# Altium project HV-60D.PrjPcb (part 1 of 2)
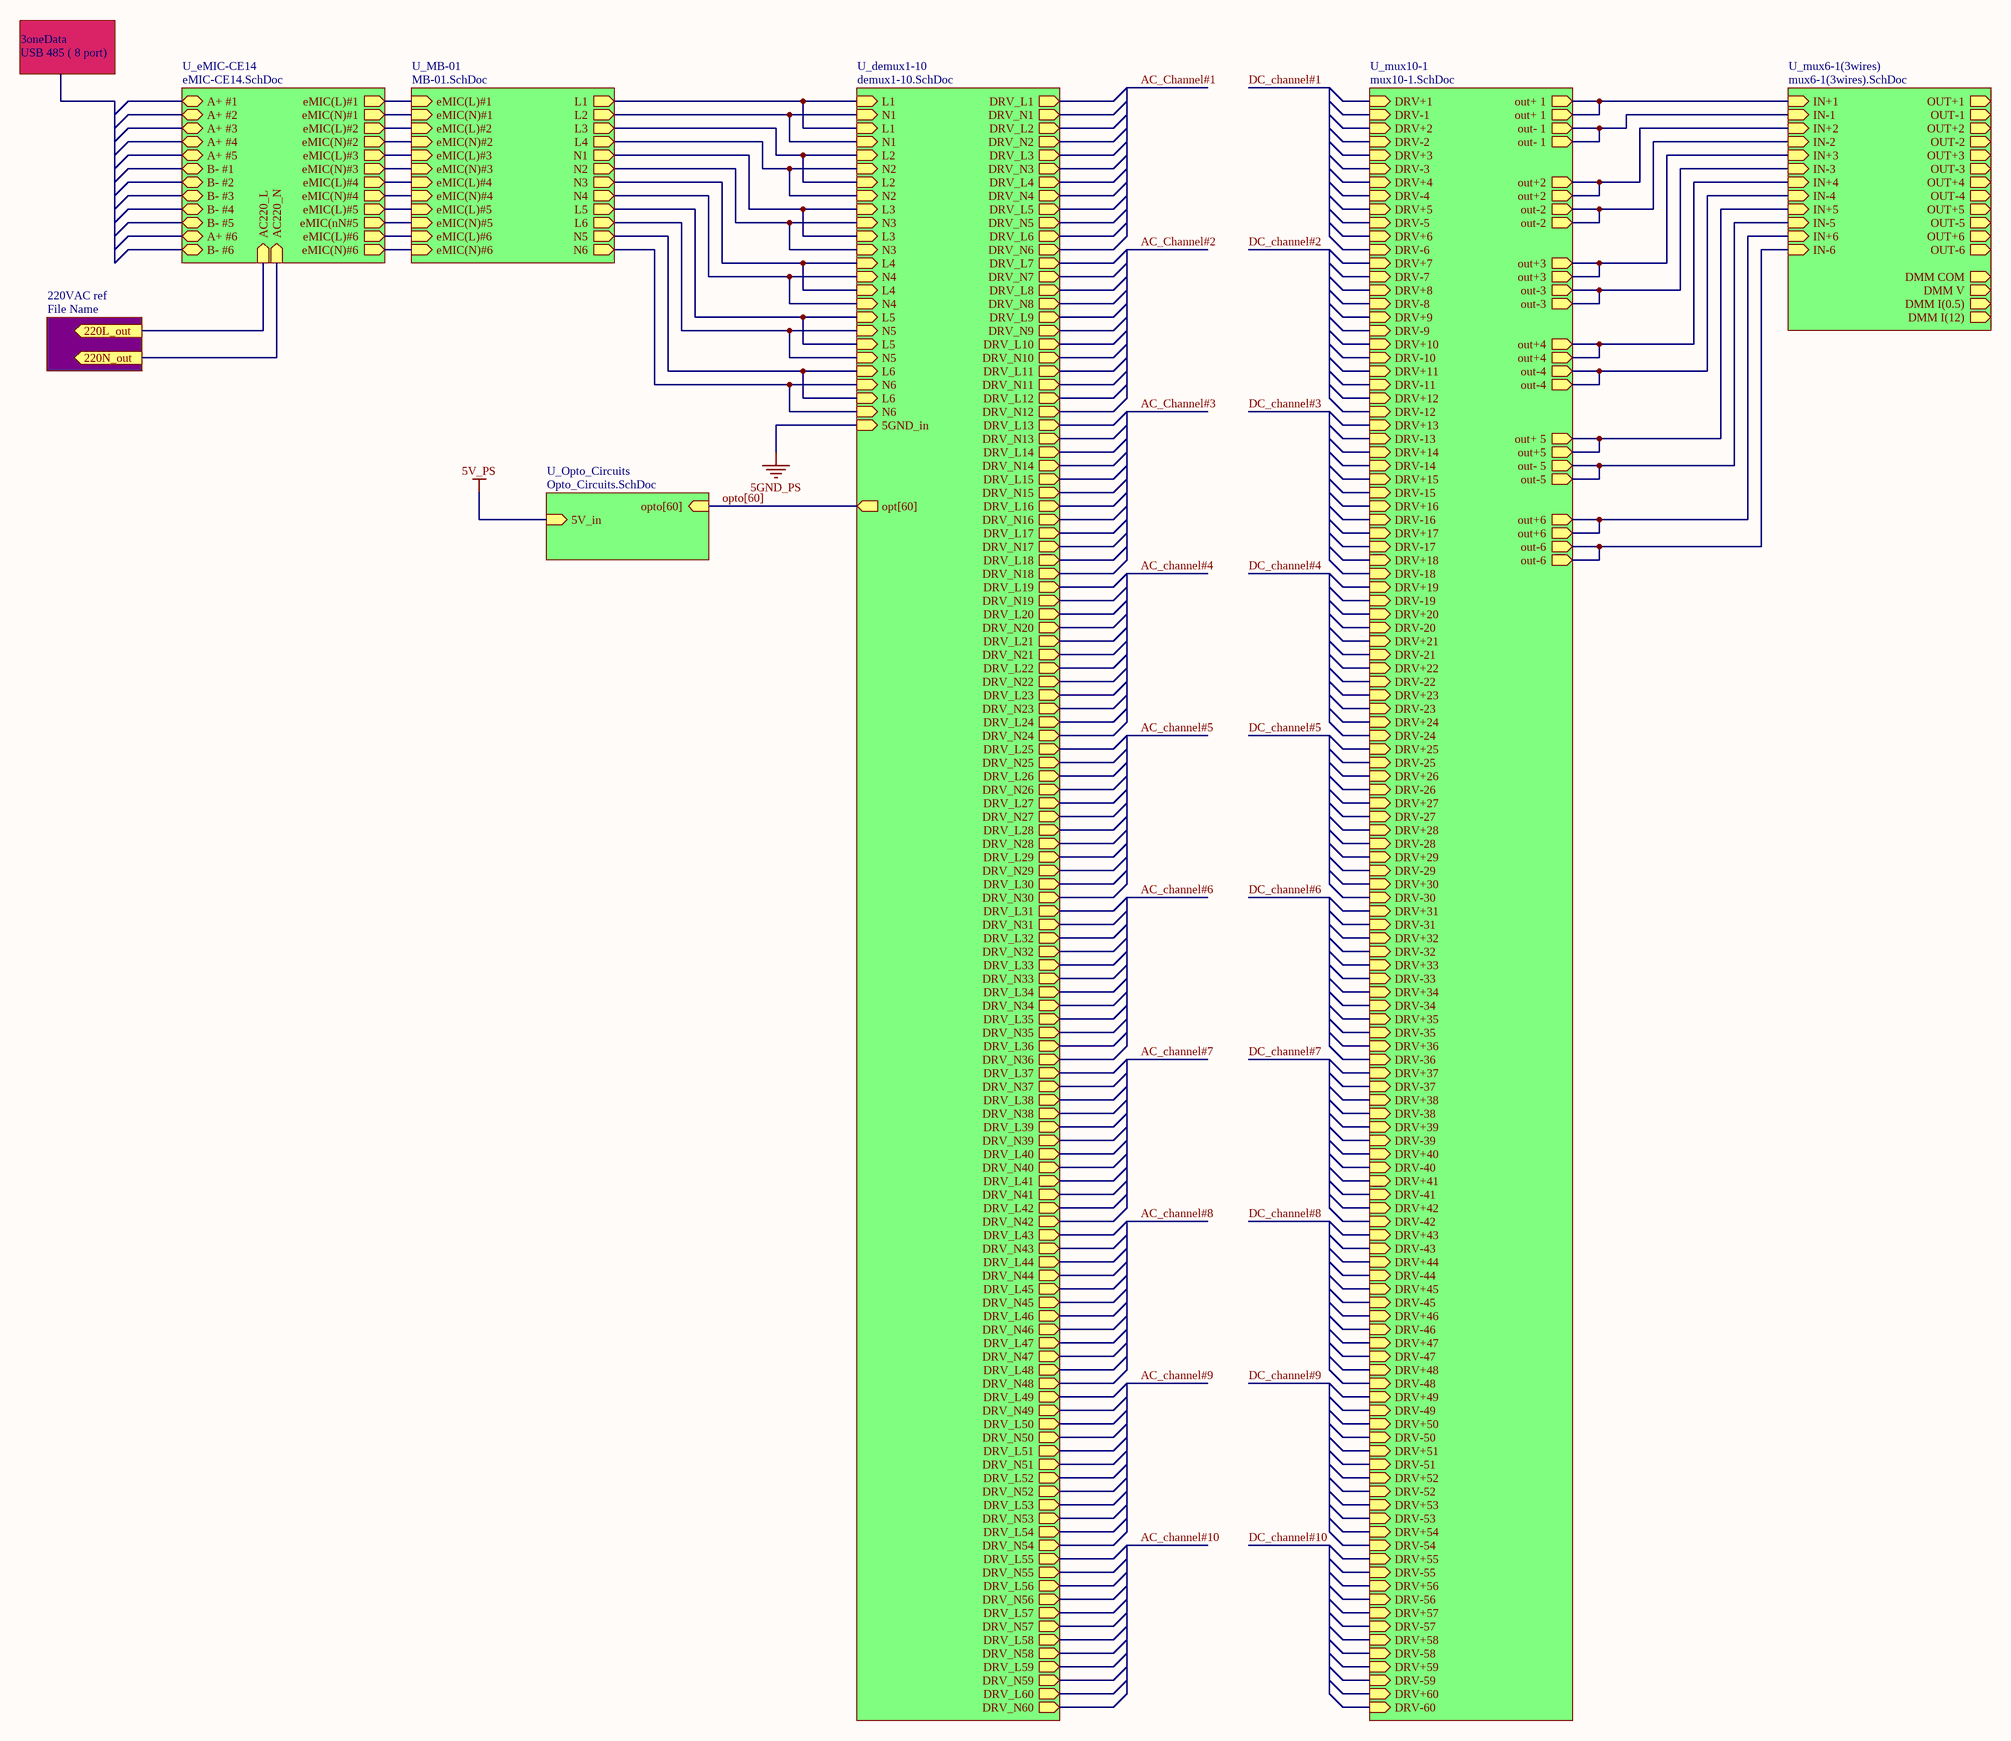
[diagram p0: HV60D_Top.SchDoc]
8 sheets, 92 parts. Net scope: hierarchical (ports join the sheet entries above them; power ports are global).
Sheets:
  HV60D_Top.SchDoc
    U_Opto_Circuits = Opto_Circuits.SchDoc
    U_demux1-10 = demux1-10.SchDoc
    U_MB-01 = MB-01.SchDoc
    U_eMIC-CE14 = eMIC-CE14.SchDoc
    U_mux10-1 = mux10-1.SchDoc
    U_mux6-1(3wires) = mux6-1(3wires).SchDoc
  mux6-1(3wires)_sche.SchDoc

## Sheet HV60D_Top.SchDoc
size A1

### Sub-sheets
220VAC ref = File Name (file not in this document): no entries
U_demux1-10 = demux1-10.SchDoc: L1 (in), N1 (in), L1 (in), N1 (in), DRV_L1 (out), DRV_L7 (out), L5 (in), N5 (in), L2 (in), N2 (in), L2 (in), N2 (in), L5 (in), N5 (in), L3 (in), N3 (in), L3 (in), N3 (in), L6 (in), N6 (in), L4 (in), N4 (in), L4 (in), N4 (in), L6 (in), N6 (in), DRV_L2 (out), DRV_L3 (out), DRV_L4 (out), DRV_L49 (out), DRV_L51 (out), DRV_L8 (out), DRV_L9 (out), DRV_L10 (out), DRV_L55 (out), DRV_L13 (out), DRV_L14 (out), DRV_L15 (out), DRV_L16 (out), DRV_L5 (out), DRV_L6 (out), DRV_L19 (out), DRV_L20 (out), DRV_L21 (out), DRV_L22 (out), DRV_L11 (out), DRV_L12 (out), DRV_L25 (out), DRV_L26 (out), DRV_L27 (out), DRV_L28 (out), DRV_L17 (out), DRV_L18 (out), DRV_L31 (out), DRV_L32 (out), DRV_L33 (out), DRV_L34 (out), DRV_L23 (out), DRV_L24 (out), DRV_L37 (out), DRV_L38 (out), DRV_L39 (out), DRV_L40 (out), DRV_L29 (out), DRV_L30 (out), DRV_L43 (out), DRV_L44 (out), DRV_L45 (out), DRV_L46 (out), DRV_L50 (out), DRV_L52 (out), DRV_L58 (out), DRV_L56 (out), DRV_L57 (out), DRV_L35 (out), DRV_L41 (out), DRV_L47 (out), DRV_L53 (out), DRV_L59 (out), DRV_L36 (out), DRV_L42 (out), DRV_L48 (out), DRV_L54 (out), DRV_L60 (out), DRV_N1 (out), DRV_N2 (out), DRV_N3 (out), DRV_N4 (out), DRV_N5 (out), DRV_N6 (out), DRV_N7 (out), DRV_N8 (out), DRV_N9 (out), DRV_N10 (out), DRV_N11 (out), DRV_N12 (out), DRV_N13 (out), DRV_N14 (out), DRV_N15 (out), DRV_N16 (out), DRV_N17 (out), DRV_N18 (out), DRV_N19 (out), DRV_N20 (out), DRV_N21 (out), DRV_N22 (out), DRV_N23 (out), DRV_N24 (out), DRV_N25 (out), DRV_N26 (out), DRV_N27 (out), DRV_N28 (out), DRV_N29 (out), DRV_N30 (out), DRV_N31 (out), DRV_N32 (out), DRV_N33 (out), DRV_N34 (out), DRV_N35 (out), DRV_N36 (out), DRV_N37 (out), DRV_N38 (out), DRV_N39 (out), DRV_N40 (out), DRV_N41 (out), DRV_N42 (out), DRV_N43 (out), DRV_N44 (out), DRV_N45 (out), DRV_N46 (out), DRV_N47 (out), DRV_N48 (out), DRV_N49 (out), DRV_N50 (out), DRV_N51 (out), DRV_N52 (out), DRV_N53 (out), DRV_N54 (out), DRV_N55 (out), DRV_N56 (out), DRV_N57 (out), DRV_N58 (out), DRV_N59 (out), DRV_N60 (out), opt[60] (out), 5GND_in (in)
U_eMIC-CE14 = eMIC-CE14.SchDoc: A+ #1 (bidir), A+ #2 (bidir), A+ #3 (bidir), A+ #4 (bidir), A+ #5 (bidir), B- #1 (bidir), B- #2 (bidir), B- #3 (bidir), B- #4 (bidir), B- #5 (bidir), A+ #6 (bidir), B- #6 (bidir), AC220_L (in), AC220_N (in), eMIC(L)#1 (out), eMIC(N)#1 (out), eMIC(L)#2 (out), eMIC(L)#3 (out), eMIC(L)#4 (out), eMIC(L)#5 (out), eMIC(L)#6 (out), eMIC(N)#2 (out), eMIC(N)#3 (out), eMIC(N)#4 (out), eMIC(nN#5 (out), eMIC(N)#6 (out)
U_MB-01 = MB-01.SchDoc: eMIC(L)#1 (in), eMIC(L)#2 (in), eMIC(L)#3 (in), eMIC(L)#4 (in), eMIC(N)#1 (in), eMIC(N)#2 (in), eMIC(N)#3 (in), eMIC(N)#4 (in), L1 (out), L2 (out), L3 (out), L4 (out), N1 (out), N2 (out), N3 (out), N4 (out), eMIC(L)#5 (in), eMIC(L)#6 (in), eMIC(N)#5 (in), eMIC(N)#6 (in), L5 (out), L6 (out), N5 (out), N6 (out)
U_mux6-1(3wires) = mux6-1(3wires).SchDoc: IN+1 (in), IN+2 (in), IN+3 (in), IN+4 (in), IN+5 (in), IN+6 (in), IN-1 (in), IN-2 (in), IN-3 (in), IN-4 (in), IN-5 (in), IN-6 (in), OUT+1 (out), OUT+2 (out), OUT+3 (out), OUT+4 (out), OUT+5 (out), OUT+6 (out), OUT-6 (out), OUT-5 (out), OUT-4 (out), OUT-3 (out), OUT-2 (out), OUT-1 (out), DMM COM (out), DMM V (out), DMM I(0.5) (out), DMM I(12) (out)
U_mux10-1 = mux10-1.SchDoc: out+ 1 (out), out- 1 (out), out+ 1 (out), out- 1 (out), out+ 5 (out), out- 5 (out), DRV+1 (in), DRV+7 (in), DRV+13 (in), DRV+19 (in), DRV+25 (in), DRV+31 (in), DRV+37 (in), DRV+43 (in), DRV-1 (in), DRV-7 (in), DRV-13 (in), DRV-19 (in), DRV-25 (in), DRV-31 (in), DRV-37 (in), DRV-43 (in), DRV+49 (in), DRV+55 (in), DRV+5 (in), DRV+11 (in), DRV+17 (in), DRV+23 (in), DRV+29 (in), DRV-49 (in), DRV-55 (in), DRV-5 (in), DRV-11 (in), DRV-17 (in), DRV-23 (in), DRV-29 (in), out+2 (out), out-2 (out), out+2 (out), out-2 (out), out+5 (out), out-5 (out), DRV+2 (in), DRV+8 (in), DRV+14 (in), DRV+20 (in), DRV+26 (in), DRV+32 (in), DRV+38 (in), DRV+44 (in), DRV-2 (in), DRV-8 (in), DRV-14 (in), DRV-20 (in), DRV-26 (in), DRV-32 (in), DRV-38 (in), DRV-44 (in), DRV+50 (in), DRV+56 (in), DRV+35 (in), DRV+41 (in), DRV+47 (in), DRV+53 (in), DRV+59 (in), DRV-50 (in), DRV-56 (in), DRV-35 (in), DRV-41 (in), DRV-47 (in), DRV-53 (in), DRV-59 (in), out+3 (out), out-3 (out), out+3 (out), out-3 (out), out+6 (out), out-6 (out), DRV+3 (in), DRV+9 (in), DRV+15 (in), DRV+21 (in), DRV+27 (in), DRV+33 (in), DRV+39 (in), DRV+45 (in), DRV-3 (in), DRV-9 (in), DRV-15 (in), DRV-21 (in), DRV-27 (in), DRV-33 (in), DRV-39 (in), DRV-45 (in), DRV+51 (in), DRV+57 (in), DRV+6 (in), DRV+12 (in), DRV+18 (in), DRV+24 (in), DRV+30 (in), DRV-51 (in), DRV-57 (in), DRV-6 (in), DRV-12 (in), DRV-18 (in), DRV-24 (in), DRV-30 (in), out+4 (out), out-4 (out), out+4 (out), out-4 (out), out+6 (out), out-6 (out), DRV+4 (in), DRV+10 (in), DRV+16 (in), DRV+22 (in), DRV+28 (in), DRV+34 (in), DRV+40 (in), DRV+46 (in), DRV-4 (in), DRV-10 (in), DRV-16 (in), DRV-22 (in), DRV-28 (in), DRV-34 (in), DRV-40 (in), DRV-46 (in), DRV+52 (in), DRV+58 (in), DRV+36 (in), DRV+42 (in), DRV+48 (in), DRV+54 (in), DRV+60 (in), DRV-52 (in), DRV-58 (in), DRV-36 (in), DRV-42 (in), DRV-48 (in), DRV-54 (in), DRV-60 (in)
U_Opto_Circuits = Opto_Circuits.SchDoc: opto[60] (in), 5V_in (in)
USB 485 ( 8 port) = 3oneData (file not in this document): no entries

### Ports
220L_out (out), 220N_out (out)

### Nets
COM_B_1: sheet U_demux1-10/L1, sheet U_demux1-10/L1, sheet U_demux1-10/L2, sheet U_demux1-10/L2, sheet U_demux1-10/L3, sheet U_demux1-10/L3, sheet U_demux1-10/L4, sheet U_demux1-10/L4, sheet U_MB-01/L1, sheet U_MB-01/L3, sheet U_MB-01/N1, sheet U_MB-01/N3
COM_B_1: sheet U_demux1-10/DRV_L1, sheet U_demux1-10/DRV_L2, sheet U_demux1-10/DRV_L3, sheet U_demux1-10/DRV_L4  [a separate net that carries the same name]
COM_B_1: sheet U_mux10-1/out+ 1, sheet U_mux10-1/out+ 1, sheet U_mux10-1/out+2, sheet U_mux10-1/out+2, sheet U_mux10-1/out+3, sheet U_mux10-1/out+3, sheet U_mux10-1/out+4, sheet U_mux10-1/out+4, sheet U_mux6-1(3wires)/IN+1, sheet U_mux6-1(3wires)/IN+2, sheet U_mux6-1(3wires)/IN+3, sheet U_mux6-1(3wires)/IN+4  [a separate net that carries the same name]
COM_B_2: sheet U_demux1-10/DRV_L7, sheet U_demux1-10/DRV_L8, sheet U_demux1-10/DRV_L9, sheet U_demux1-10/DRV_L10
COM_B_3: sheet U_demux1-10/N1, sheet U_demux1-10/N1, sheet U_demux1-10/N2, sheet U_demux1-10/N2, sheet U_demux1-10/N3, sheet U_demux1-10/N3, sheet U_demux1-10/N4, sheet U_demux1-10/N4, sheet U_MB-01/L2, sheet U_MB-01/L4, sheet U_MB-01/N2, sheet U_MB-01/N4
COM_B_3: sheet U_demux1-10/DRV_L13, sheet U_demux1-10/DRV_L14, sheet U_demux1-10/DRV_L15, sheet U_demux1-10/DRV_L16  [a separate net that carries the same name]
COM_B_4: sheet U_demux1-10/DRV_L19, sheet U_demux1-10/DRV_L20, sheet U_demux1-10/DRV_L21, sheet U_demux1-10/DRV_L22
COM_B_5: sheet U_demux1-10/DRV_L25, sheet U_demux1-10/DRV_L26, sheet U_demux1-10/DRV_L27, sheet U_demux1-10/DRV_L28
COM_B_6: sheet U_demux1-10/DRV_L31, sheet U_demux1-10/DRV_L32, sheet U_demux1-10/DRV_L33, sheet U_demux1-10/DRV_L34
COM_B_7: sheet U_demux1-10/DRV_L37, sheet U_demux1-10/DRV_L38, sheet U_demux1-10/DRV_L39, sheet U_demux1-10/DRV_L40
COM_B_8: sheet U_demux1-10/DRV_L43, sheet U_demux1-10/DRV_L44, sheet U_demux1-10/DRV_L45, sheet U_demux1-10/DRV_L46
COM_B_9: sheet U_demux1-10/DRV_L49, sheet U_demux1-10/DRV_L52
COM_B_10: sheet U_demux1-10/L5, sheet U_demux1-10/L5, sheet U_demux1-10/L6, sheet U_demux1-10/L6, sheet U_MB-01/L5, sheet U_MB-01/N5
COM_B_10: sheet U_demux1-10/DRV_L55, sheet U_demux1-10/DRV_L58, sheet U_demux1-10/DRV_L56, sheet U_demux1-10/DRV_L57  [a separate net that carries the same name]
COM_B_11: sheet U_demux1-10/N5, sheet U_demux1-10/N5, sheet U_demux1-10/N6, sheet U_demux1-10/N6, sheet U_MB-01/L6, sheet U_MB-01/N6
COM_B_11: sheet U_demux1-10/DRV_L5, sheet U_demux1-10/DRV_L6, sheet U_demux1-10/DRV_L35, sheet U_demux1-10/DRV_L36  [a separate net that carries the same name]
COM_B_11: sheet U_mux10-1/out+ 5, sheet U_mux10-1/out+5, sheet U_mux10-1/out+6, sheet U_mux10-1/out+6, sheet U_mux6-1(3wires)/IN+5, sheet U_mux6-1(3wires)/IN+6  [a separate net that carries the same name]
COM_B_12: sheet U_demux1-10/DRV_L11, sheet U_demux1-10/DRV_L12, sheet U_demux1-10/DRV_L41, sheet U_demux1-10/DRV_L42
COM_B_13: sheet U_demux1-10/DRV_L17, sheet U_demux1-10/DRV_L18, sheet U_demux1-10/DRV_L47, sheet U_demux1-10/DRV_L48
COM_B_14: sheet U_demux1-10/DRV_L23, sheet U_demux1-10/DRV_L24, sheet U_demux1-10/DRV_L53, sheet U_demux1-10/DRV_L54
COM_B_15: sheet U_demux1-10/DRV_L29, sheet U_demux1-10/DRV_L30, sheet U_demux1-10/DRV_L59, sheet U_demux1-10/DRV_L60
COM_C_1: sheet U_demux1-10/DRV_N1, sheet U_demux1-10/DRV_N2, sheet U_demux1-10/DRV_N3, sheet U_demux1-10/DRV_N4
COM_C_1: sheet U_mux10-1/out- 1, sheet U_mux10-1/out- 1, sheet U_mux10-1/out-2, sheet U_mux10-1/out-2, sheet U_mux10-1/out-3, sheet U_mux10-1/out-3, sheet U_mux10-1/out-4, sheet U_mux10-1/out-4, sheet U_mux6-1(3wires)/IN-1, sheet U_mux6-1(3wires)/IN-2, sheet U_mux6-1(3wires)/IN-3, sheet U_mux6-1(3wires)/IN-4  [a separate net that carries the same name]
COM_C_2: sheet U_demux1-10/DRV_N7, sheet U_demux1-10/DRV_N8, sheet U_demux1-10/DRV_N9, sheet U_demux1-10/DRV_N10
COM_C_3: sheet U_demux1-10/DRV_N13, sheet U_demux1-10/DRV_N14, sheet U_demux1-10/DRV_N15, sheet U_demux1-10/DRV_N16
COM_C_4: sheet U_demux1-10/DRV_N19, sheet U_demux1-10/DRV_N20, sheet U_demux1-10/DRV_N21, sheet U_demux1-10/DRV_N22
COM_C_5: sheet U_demux1-10/DRV_N25, sheet U_demux1-10/DRV_N26, sheet U_demux1-10/DRV_N27, sheet U_demux1-10/DRV_N28
COM_C_6: sheet U_demux1-10/DRV_N31, sheet U_demux1-10/DRV_N32, sheet U_demux1-10/DRV_N33, sheet U_demux1-10/DRV_N34
COM_C_7: sheet U_demux1-10/DRV_N37, sheet U_demux1-10/DRV_N38, sheet U_demux1-10/DRV_N39, sheet U_demux1-10/DRV_N40
COM_C_8: sheet U_demux1-10/DRV_N43, sheet U_demux1-10/DRV_N44, sheet U_demux1-10/DRV_N45, sheet U_demux1-10/DRV_N46
COM_C_9: sheet U_demux1-10/DRV_N49, sheet U_demux1-10/DRV_N50, sheet U_demux1-10/DRV_N51, sheet U_demux1-10/DRV_N52
COM_C_10: sheet U_demux1-10/DRV_N55, sheet U_demux1-10/DRV_N56, sheet U_demux1-10/DRV_N57, sheet U_demux1-10/DRV_N58
COM_C_11: sheet U_demux1-10/DRV_N5, sheet U_demux1-10/DRV_N6, sheet U_demux1-10/DRV_N35, sheet U_demux1-10/DRV_N36
COM_C_11: sheet U_mux10-1/out- 5, sheet U_mux10-1/out-5, sheet U_mux10-1/out-6, sheet U_mux10-1/out-6, sheet U_mux6-1(3wires)/IN-5, sheet U_mux6-1(3wires)/IN-6  [a separate net that carries the same name]
COM_C_12: sheet U_demux1-10/DRV_N11, sheet U_demux1-10/DRV_N12, sheet U_demux1-10/DRV_N41, sheet U_demux1-10/DRV_N42
COM_C_13: sheet U_demux1-10/DRV_N17, sheet U_demux1-10/DRV_N18, sheet U_demux1-10/DRV_N47, sheet U_demux1-10/DRV_N48
COM_C_14: sheet U_demux1-10/DRV_N23, sheet U_demux1-10/DRV_N24, sheet U_demux1-10/DRV_N53, sheet U_demux1-10/DRV_N54
COM_C_15: sheet U_demux1-10/DRV_N29, sheet U_demux1-10/DRV_N30, sheet U_demux1-10/DRV_N59, sheet U_demux1-10/DRV_N60
NO_B_1: sheet U_MB-01/eMIC(L)#1, sheet U_eMIC-CE14/eMIC(L)#1
NO_B_1: sheet U_mux10-1/DRV+1, sheet U_mux10-1/DRV+2, sheet U_mux10-1/DRV+3, sheet U_mux10-1/DRV+4  [a separate net that carries the same name]
NO_B_2: sheet U_MB-01/eMIC(N)#1, sheet U_eMIC-CE14/eMIC(N)#1
NO_B_2: sheet U_mux10-1/DRV+7, sheet U_mux10-1/DRV+8, sheet U_mux10-1/DRV+9, sheet U_mux10-1/DRV+10  [a separate net that carries the same name]
NO_B_3: sheet U_MB-01/eMIC(L)#2, sheet U_eMIC-CE14/eMIC(L)#2
NO_B_3: sheet U_mux10-1/DRV+13, sheet U_mux10-1/DRV+14, sheet U_mux10-1/DRV+15, sheet U_mux10-1/DRV+16  [a separate net that carries the same name]
NO_B_4: sheet U_MB-01/eMIC(N)#2, sheet U_eMIC-CE14/eMIC(N)#2
NO_B_4: sheet U_mux10-1/DRV+19, sheet U_mux10-1/DRV+20, sheet U_mux10-1/DRV+21, sheet U_mux10-1/DRV+22  [a separate net that carries the same name]
NO_B_5: sheet U_MB-01/eMIC(L)#3, sheet U_eMIC-CE14/eMIC(L)#3
NO_B_5: sheet U_mux10-1/DRV+25, sheet U_mux10-1/DRV+26, sheet U_mux10-1/DRV+27, sheet U_mux10-1/DRV+28  [a separate net that carries the same name]
NO_B_6: sheet U_MB-01/eMIC(N)#3, sheet U_eMIC-CE14/eMIC(N)#3
NO_B_6: sheet U_mux10-1/DRV+31, sheet U_mux10-1/DRV+32, sheet U_mux10-1/DRV+33, sheet U_mux10-1/DRV+34  [a separate net that carries the same name]
NO_B_7: sheet U_MB-01/eMIC(L)#4, sheet U_eMIC-CE14/eMIC(L)#4
NO_B_7: sheet U_mux10-1/DRV+37, sheet U_mux10-1/DRV+38, sheet U_mux10-1/DRV+39, sheet U_mux10-1/DRV+40  [a separate net that carries the same name]
NO_B_8: sheet U_MB-01/eMIC(N)#4, sheet U_eMIC-CE14/eMIC(N)#4
NO_B_8: sheet U_mux10-1/DRV+43, sheet U_mux10-1/DRV+44, sheet U_mux10-1/DRV+45, sheet U_mux10-1/DRV+46  [a separate net that carries the same name]
NO_B_9: sheet U_MB-01/eMIC(L)#5, sheet U_eMIC-CE14/eMIC(L)#5
NO_B_9: sheet U_mux10-1/DRV+49, sheet U_mux10-1/DRV+50, sheet U_mux10-1/DRV+51, sheet U_mux10-1/DRV+52  [a separate net that carries the same name]
NO_B_10: sheet U_MB-01/eMIC(N)#5, sheet U_eMIC-CE14/eMIC(nN#5
NO_B_10: sheet U_mux10-1/DRV+55, sheet U_mux10-1/DRV+56, sheet U_mux10-1/DRV+57, sheet U_mux10-1/DRV+58  [a separate net that carries the same name]
NO_B_11: sheet U_MB-01/eMIC(L)#6, sheet U_eMIC-CE14/eMIC(L)#6
NO_B_11: sheet U_mux10-1/DRV+5, sheet U_mux10-1/DRV+35, sheet U_mux10-1/DRV+6, sheet U_mux10-1/DRV+36  [a separate net that carries the same name]
NO_B_12: sheet U_MB-01/eMIC(N)#6, sheet U_eMIC-CE14/eMIC(N)#6
NO_B_12: sheet U_mux10-1/DRV+11, sheet U_mux10-1/DRV+41, sheet U_mux10-1/DRV+12, sheet U_mux10-1/DRV+42  [a separate net that carries the same name]
NO_B_13: sheet U_mux10-1/DRV+17, sheet U_mux10-1/DRV+47, sheet U_mux10-1/DRV+18, sheet U_mux10-1/DRV+48
NO_B_14: sheet U_mux10-1/DRV+23, sheet U_mux10-1/DRV+53, sheet U_mux10-1/DRV+24, sheet U_mux10-1/DRV+54
NO_B_15: sheet U_mux10-1/DRV+29, sheet U_mux10-1/DRV+59, sheet U_mux10-1/DRV+30, sheet U_mux10-1/DRV+60
NO_C_1: sheet U_mux10-1/DRV-1, sheet U_mux10-1/DRV-2, sheet U_mux10-1/DRV-3, sheet U_mux10-1/DRV-4
NO_C_2: sheet U_mux10-1/DRV-7, sheet U_mux10-1/DRV-8, sheet U_mux10-1/DRV-9, sheet U_mux10-1/DRV-10
NO_C_3: sheet U_mux10-1/DRV-13, sheet U_mux10-1/DRV-14, sheet U_mux10-1/DRV-15, sheet U_mux10-1/DRV-16
NO_C_4: sheet U_mux10-1/DRV-19, sheet U_mux10-1/DRV-20, sheet U_mux10-1/DRV-21, sheet U_mux10-1/DRV-22
NO_C_5: sheet U_mux10-1/DRV-25, sheet U_mux10-1/DRV-26, sheet U_mux10-1/DRV-27, sheet U_mux10-1/DRV-28
NO_C_6: sheet U_mux10-1/DRV-31, sheet U_mux10-1/DRV-32, sheet U_mux10-1/DRV-33, sheet U_mux10-1/DRV-34
NO_C_7: sheet U_mux10-1/DRV-37, sheet U_mux10-1/DRV-38, sheet U_mux10-1/DRV-39, sheet U_mux10-1/DRV-40
NO_C_8: sheet U_mux10-1/DRV-43, sheet U_mux10-1/DRV-44, sheet U_mux10-1/DRV-45, sheet U_mux10-1/DRV-46
NO_C_9: sheet U_mux10-1/DRV-49, sheet U_mux10-1/DRV-50, sheet U_mux10-1/DRV-51, sheet U_mux10-1/DRV-52
NO_C_10: sheet U_mux10-1/DRV-55, sheet U_mux10-1/DRV-56, sheet U_mux10-1/DRV-57, sheet U_mux10-1/DRV-58
NO_C_11: sheet U_mux10-1/DRV-5, sheet U_mux10-1/DRV-35, sheet U_mux10-1/DRV-6, sheet U_mux10-1/DRV-36
NO_C_12: sheet U_mux10-1/DRV-11, sheet U_mux10-1/DRV-41, sheet U_mux10-1/DRV-12, sheet U_mux10-1/DRV-42
NO_C_13: sheet U_mux10-1/DRV-17, sheet U_mux10-1/DRV-47, sheet U_mux10-1/DRV-18, sheet U_mux10-1/DRV-48
NO_C_14: sheet U_mux10-1/DRV-23, sheet U_mux10-1/DRV-53, sheet U_mux10-1/DRV-24, sheet U_mux10-1/DRV-54
NO_C_15: sheet U_mux10-1/DRV-29, sheet U_mux10-1/DRV-59, sheet U_mux10-1/DRV-30, sheet U_mux10-1/DRV-60
(unnamed): port 220L_out, sheet U_eMIC-CE14/AC220_L
(unnamed): port 220N_out, sheet U_eMIC-CE14/AC220_N

### Buses and harness runs
bus AC_Channel#1
bus AC_Channel#2
bus AC_Channel#3
bus AC_channel#4
bus AC_channel#5
bus AC_channel#6
bus AC_channel#7
bus AC_channel#8
bus AC_channel#9
bus AC_channel#10
bus DC_channel#1
bus DC_channel#2
bus DC_channel#3
bus DC_channel#4
bus DC_channel#5
bus DC_channel#6
bus DC_channel#7
bus DC_channel#8
bus DC_channel#9
bus DC_channel#10
bus opto[60] = sheet U_demux1-10/opt[60] = sheet U_Opto_Circuits/opto[60]

## Sheet Opto_Circuits.SchDoc
size A
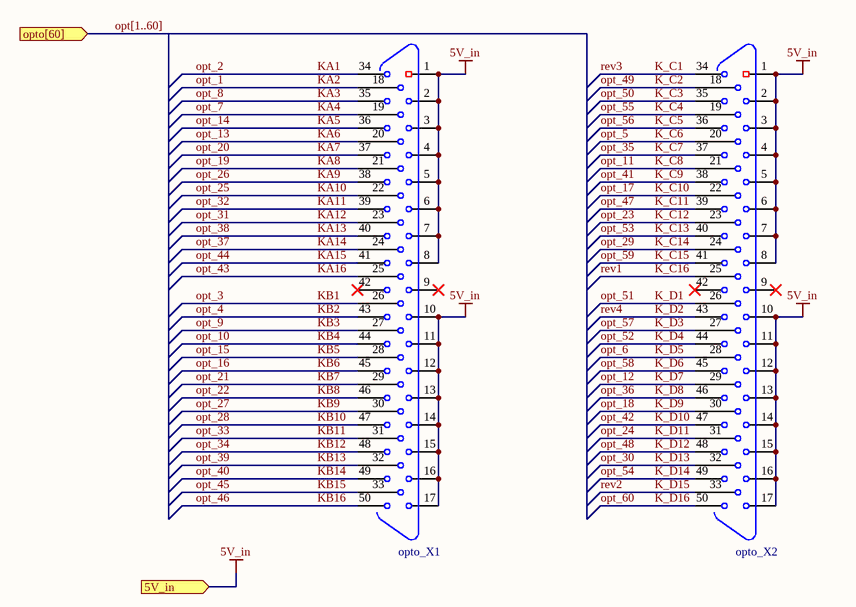
[diagram p1: Opto_Circuits.SchDoc]

### Parts
opto_X1  DB50  [DB50_RA]  (value not drawn)
opto_X2  DB50  [DB50_RA]  (value not drawn)

### Ports
5V_in (in), opto[60] (in)

### Nets
5V_in: opto_X1.1 opto_X1.2 opto_X1.3 opto_X1.4 opto_X1.5 opto_X1.6 opto_X1.7 opto_X1.8 opto_X1.10 opto_X1.11 opto_X1.12 opto_X1.13 opto_X1.14 opto_X1.15 opto_X1.16 opto_X1.17 opto_X2.1 opto_X2.2 opto_X2.3 opto_X2.4 opto_X2.5 opto_X2.6 opto_X2.7 opto_X2.8 opto_X2.10 opto_X2.11 opto_X2.12 opto_X2.13 opto_X2.14 opto_X2.15 opto_X2.16 opto_X2.17 ; port 5V_in
K_C1: opto_X2.34  [also labelled rev3]
K_C2: opto_X2.18  [also labelled opt_49]
K_C3: opto_X2.35  [also labelled opt_50]
K_C4: opto_X2.19  [also labelled opt_55]
K_C5: opto_X2.36  [also labelled opt_56]
K_C6: opto_X2.20  [also labelled opt_5]
K_C7: opto_X2.37  [also labelled opt_35]
K_C8: opto_X2.21  [also labelled opt_11]
K_C9: opto_X2.38  [also labelled opt_41]
K_C10: opto_X2.22  [also labelled opt_17]
K_C11: opto_X2.39  [also labelled opt_47]
K_C12: opto_X2.23  [also labelled opt_23]
K_C13: opto_X2.40  [also labelled opt_53]
K_C14: opto_X2.24  [also labelled opt_29]
K_C15: opto_X2.41  [also labelled opt_59]
K_C16: opto_X2.25  [also labelled rev1]
K_D1: opto_X2.26  [also labelled opt_51]
K_D2: opto_X2.43  [also labelled rev4]
K_D3: opto_X2.27  [also labelled opt_57]
K_D4: opto_X2.44  [also labelled opt_52]
K_D5: opto_X2.28  [also labelled opt_6]
K_D6: opto_X2.45  [also labelled opt_58]
K_D7: opto_X2.29  [also labelled opt_12]
K_D8: opto_X2.46  [also labelled opt_36]
K_D9: opto_X2.30  [also labelled opt_18]
K_D10: opto_X2.47  [also labelled opt_42]
K_D11: opto_X2.31  [also labelled opt_24]
K_D12: opto_X2.48  [also labelled opt_48]
K_D13: opto_X2.32  [also labelled opt_30]
K_D14: opto_X2.49  [also labelled opt_54]
K_D15: opto_X2.33  [also labelled rev2]
K_D16: opto_X2.50  [also labelled opt_60]
KA1: opto_X1.34  [also labelled opt_2]
KA2: opto_X1.18  [also labelled opt_1]
KA3: opto_X1.35  [also labelled opt_8]
KA4: opto_X1.19  [also labelled opt_7]
KA5: opto_X1.36  [also labelled opt_14]
KA6: opto_X1.20  [also labelled opt_13]
KA7: opto_X1.37  [also labelled opt_20]
KA8: opto_X1.21  [also labelled opt_19]
KA9: opto_X1.38  [also labelled opt_26]
KA10: opto_X1.22  [also labelled opt_25]
KA11: opto_X1.39  [also labelled opt_32]
KA12: opto_X1.23  [also labelled opt_31]
KA13: opto_X1.40  [also labelled opt_38]
KA14: opto_X1.24  [also labelled opt_37]
KA15: opto_X1.41  [also labelled opt_44]
KA16: opto_X1.25  [also labelled opt_43]
KB1: opto_X1.26  [also labelled opt_3]
KB2: opto_X1.43  [also labelled opt_4]
KB3: opto_X1.27  [also labelled opt_9]
KB4: opto_X1.44  [also labelled opt_10]
KB5: opto_X1.28  [also labelled opt_15]
KB6: opto_X1.45  [also labelled opt_16]
KB7: opto_X1.29  [also labelled opt_21]
KB8: opto_X1.46  [also labelled opt_22]
KB9: opto_X1.30  [also labelled opt_27]
KB10: opto_X1.47  [also labelled opt_28]
KB11: opto_X1.31  [also labelled opt_33]
KB12: opto_X1.48  [also labelled opt_34]
KB13: opto_X1.32  [also labelled opt_39]
KB14: opto_X1.49  [also labelled opt_40]
KB15: opto_X1.33  [also labelled opt_45]
KB16: opto_X1.50  [also labelled opt_46]

Not connected (* = marked no-connect by the designer): opto_X1 9(4)* 42*; opto_X2 9(4)* 42*

### Buses and harness runs
bus opt[1..60] = port opto[60]

## Sheet demux1-10.SchDoc
size A2
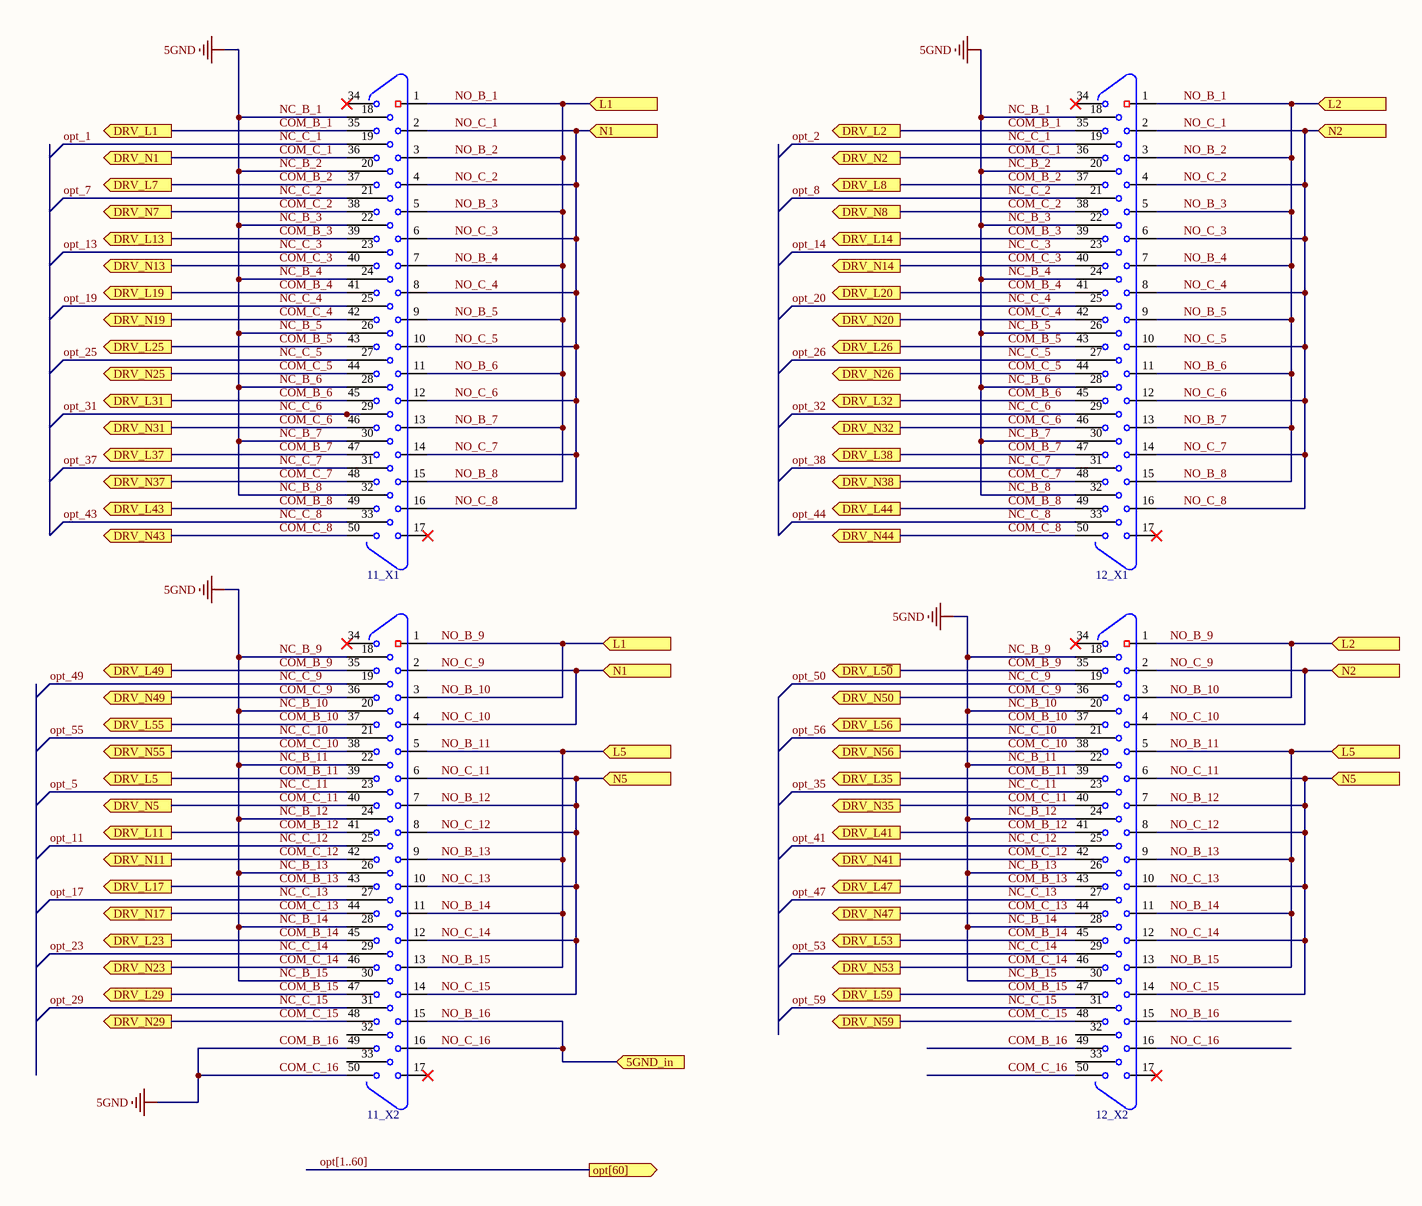
[diagram p2: demux1-10.SchDoc, left]
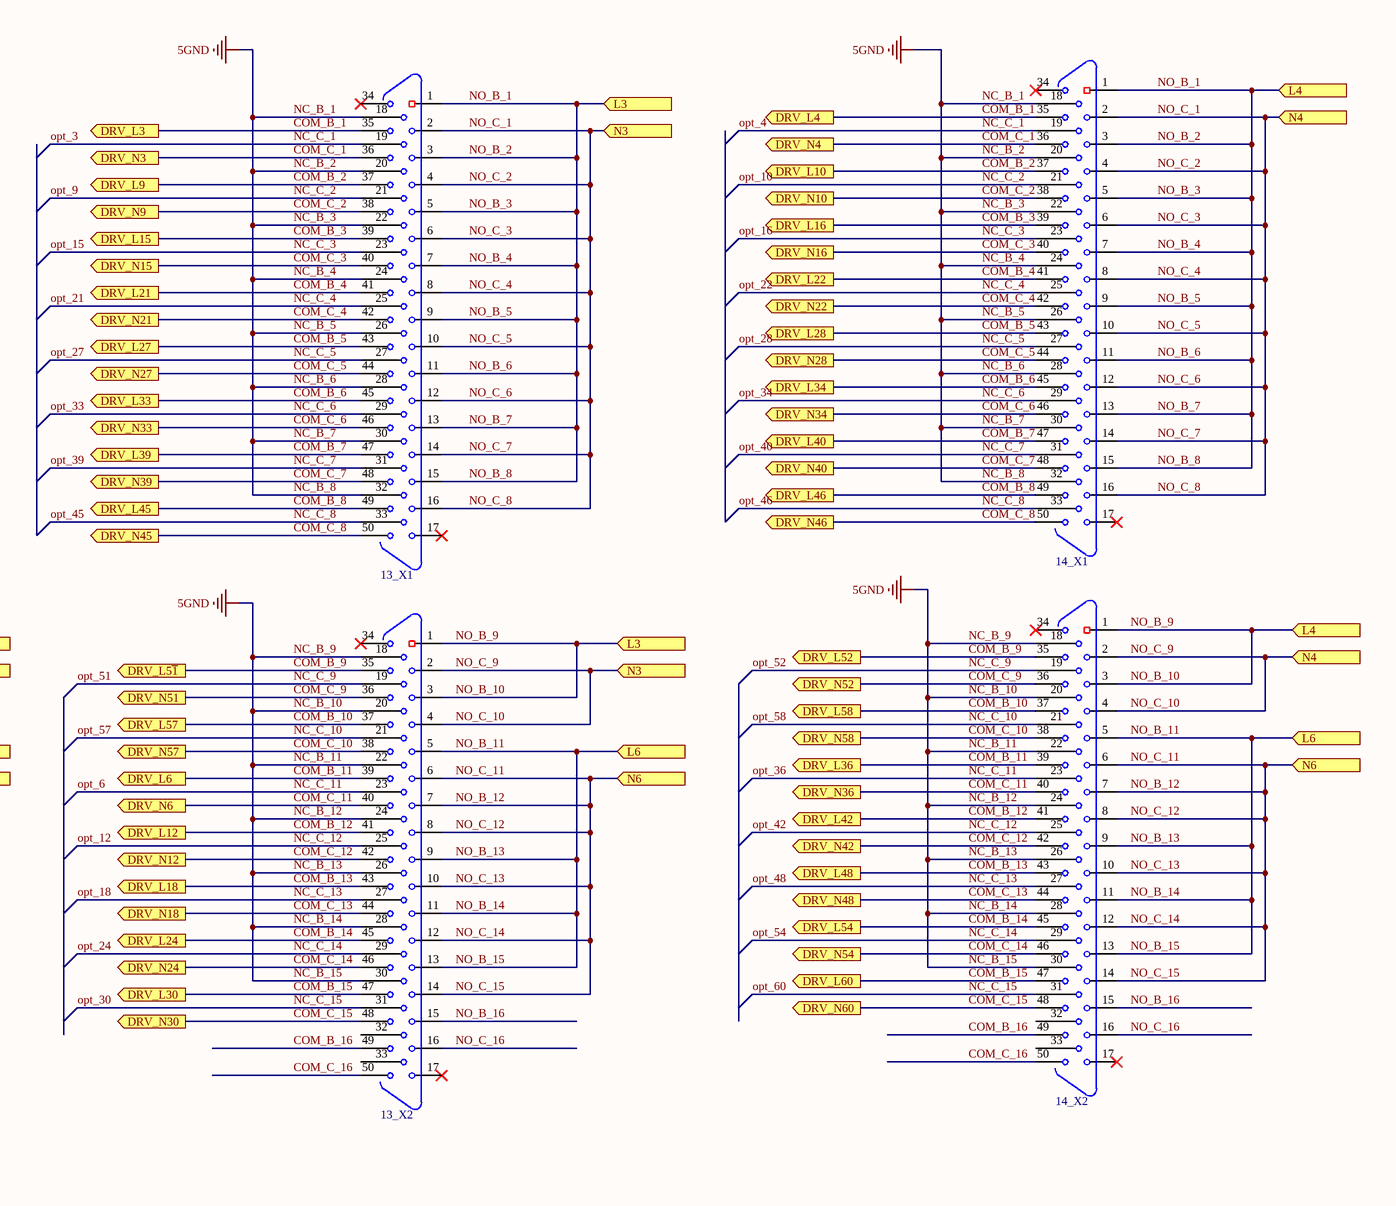
[diagram p3: demux1-10.SchDoc, right]

### Parts
11_X1  DB50  [DB50_RA]  (value not drawn)
11_X2  DB50  [DB50_RA]  (value not drawn)
12_X1  DB50  [DB50_RA]  (value not drawn)
12_X2  DB50  [DB50_RA]  (value not drawn)
13_X1  DB50  [DB50_RA]  (value not drawn)
13_X2  DB50  [DB50_RA]  (value not drawn)
14_X1  DB50  [DB50_RA]  (value not drawn)
14_X2  DB50  [DB50_RA]  (value not drawn)

### Ports
5GND_in (in), DRV_L1 (out), DRV_L2 (out), DRV_L3 (out), DRV_L4 (out), DRV_L5 (out), DRV_L5~{0} (out), DRV_L5~{1} (out), DRV_L6 (out), DRV_L7 (out), DRV_L8 (out), DRV_L9 (out), DRV_L10 (out), DRV_L11 (out), DRV_L12 (out), DRV_L13 (out), DRV_L14 (out), DRV_L15 (out), DRV_L16 (out), DRV_L17 (out), DRV_L18 (out), DRV_L19 (out), DRV_L20 (out), DRV_L21 (out), DRV_L22 (out), DRV_L23 (out), DRV_L24 (out), DRV_L25 (out), DRV_L26 (out), DRV_L27 (out), DRV_L28 (out), DRV_L29 (out), DRV_L30 (out), DRV_L31 (out), DRV_L32 (out), DRV_L33 (out), DRV_L34 (out), DRV_L35 (out), DRV_L36 (out), DRV_L37 (out), DRV_L38 (out), DRV_L39 (out), DRV_L40 (out), DRV_L41 (out), DRV_L42 (out), DRV_L43 (out), DRV_L44 (out), DRV_L45 (out), DRV_L46 (out), DRV_L47 (out), DRV_L48 (out), DRV_L49 (out), DRV_L52 (out), DRV_L53 (out), DRV_L54 (out), DRV_L55 (out), DRV_L56 (out), DRV_L57 (out), DRV_L58 (out), DRV_L59 (out), DRV_L60 (out), DRV_N1 (out), DRV_N2 (out), DRV_N3 (out), DRV_N4 (out), DRV_N5 (out), DRV_N6 (out), DRV_N7 (out), DRV_N8 (out), DRV_N9 (out), DRV_N10 (out), DRV_N11 (out), DRV_N12 (out), DRV_N13 (out), DRV_N14 (out), DRV_N15 (out), DRV_N16 (out), DRV_N17 (out), DRV_N18 (out), DRV_N19 (out), DRV_N20 (out), DRV_N21 (out), DRV_N22 (out), DRV_N23 (out), DRV_N24 (out), DRV_N25 (out), DRV_N26 (out), DRV_N27 (out), DRV_N28 (out), DRV_N29 (out), DRV_N30 (out), DRV_N31 (out), DRV_N32 (out), DRV_N33 (out), DRV_N34 (out), DRV_N35 (out), DRV_N36 (out), DRV_N37 (out), DRV_N38 (out), DRV_N39 (out), DRV_N40 (out), DRV_N41 (out), DRV_N42 (out), DRV_N43 (out), DRV_N44 (out), DRV_N45 (out), DRV_N46 (out), DRV_N47 (out), DRV_N48 (out), DRV_N49 (out), DRV_N50 (out), DRV_N51 (out), DRV_N52 (out), DRV_N53 (out), DRV_N54 (out), DRV_N55 (out), DRV_N56 (out), DRV_N57 (out), DRV_N58 (out), DRV_N59 (out), DRV_N60 (out), L1 (in), L2 (in), L3 (in), L4 (in), L5 (in), L6 (in), N1 (in), N2 (in), N3 (in), N4 (in), N5 (in), N6 (in), opt[60] (out)

### Nets
COM_B_16: 11_X1.18 11_X1.20 11_X1.22 11_X1.24 11_X1.26 11_X1.28 11_X1.30 11_X1.32 11_X2.18 11_X2.20 11_X2.22 11_X2.24 11_X2.26 11_X2.28 11_X2.30 11_X2.49 11_X2.50 12_X1.18 12_X1.20 12_X1.22 12_X1.24 12_X1.26 12_X1.28 12_X1.30 12_X1.32 12_X2.18 12_X2.20 12_X2.22 12_X2.24 12_X2.26 12_X2.28 12_X2.30 12_X2.49 12_X2.50 13_X1.18 13_X1.20 13_X1.22 13_X1.24 13_X1.26 13_X1.28 13_X1.30 13_X1.32 13_X2.18 13_X2.20 13_X2.22 13_X2.24 13_X2.26 13_X2.28 13_X2.30 13_X2.49 13_X2.50 14_X1.18 14_X1.20 14_X1.22 14_X1.24 14_X1.26 14_X1.28 14_X1.30 14_X1.32 14_X2.18 14_X2.20 14_X2.22 14_X2.24 14_X2.26 14_X2.28 14_X2.30 14_X2.49 14_X2.50  [also labelled 5GND, COM_C_16, NC_B_1, NC_B_10, NC_B_11, NC_B_12, NC_B_13, NC_B_14, NC_B_15, NC_B_2, NC_B_3, NC_B_4, NC_B_5, NC_B_6, NC_B_7, NC_B_8, NC_B_9]
NO_B_16: 11_X2.15 11_X2.16 12_X2.15 12_X2.16 13_X2.15 13_X2.16 14_X2.15 14_X2.16 ; port 5GND_in  [also labelled NO_C_16]
COM_B_1: 11_X1.35 12_X1.35 13_X1.35 14_X1.35 ; port DRV_L1, port DRV_L2, port DRV_L3, port DRV_L4
COM_B_2: 11_X1.37 12_X1.37 13_X1.37 14_X1.37 ; port DRV_L7, port DRV_L8, port DRV_L9, port DRV_L10
COM_B_3: 11_X1.39 12_X1.39 13_X1.39 14_X1.39 ; port DRV_L13, port DRV_L14, port DRV_L15, port DRV_L16
COM_B_4: 11_X1.41 12_X1.41 13_X1.41 14_X1.41 ; port DRV_L19, port DRV_L20, port DRV_L21, port DRV_L22
COM_B_5: 11_X1.43 12_X1.43 13_X1.43 14_X1.43 ; port DRV_L25, port DRV_L26, port DRV_L27, port DRV_L28
COM_B_6: 11_X1.45 12_X1.45 13_X1.45 14_X1.45 ; port DRV_L31, port DRV_L32, port DRV_L33, port DRV_L34
COM_B_7: 11_X1.47 12_X1.47 13_X1.47 14_X1.47 ; port DRV_L37, port DRV_L38, port DRV_L39, port DRV_L40
COM_B_8: 11_X1.49 12_X1.49 13_X1.49 14_X1.49 ; port DRV_L43, port DRV_L44, port DRV_L45, port DRV_L46
COM_B_9: 11_X2.35 12_X2.35 13_X2.35 14_X2.35 ; port DRV_L49, port DRV_L5~{1}, port DRV_L5~{0}, port DRV_L52
COM_B_10: 11_X2.37 12_X2.37 13_X2.37 14_X2.37 ; port DRV_L55, port DRV_L58, port DRV_L56, port DRV_L57
COM_B_11: 11_X2.39 12_X2.39 13_X2.39 14_X2.39 ; port DRV_L5, port DRV_L6, port DRV_L35, port DRV_L36
COM_B_12: 11_X2.41 12_X2.41 13_X2.41 14_X2.41 ; port DRV_L11, port DRV_L12, port DRV_L41, port DRV_L42
COM_B_13: 11_X2.43 12_X2.43 13_X2.43 14_X2.43 ; port DRV_L17, port DRV_L18, port DRV_L47, port DRV_L48
COM_B_14: 11_X2.45 12_X2.45 13_X2.45 14_X2.45 ; port DRV_L23, port DRV_L24, port DRV_L53, port DRV_L54
COM_B_15: 11_X2.47 12_X2.47 13_X2.47 14_X2.47 ; port DRV_L29, port DRV_L30, port DRV_L59, port DRV_L60
COM_C_1: 11_X1.36 12_X1.36 13_X1.36 14_X1.36 ; port DRV_N1, port DRV_N2, port DRV_N3, port DRV_N4
COM_C_2: 11_X1.38 12_X1.38 13_X1.38 14_X1.38 ; port DRV_N7, port DRV_N8, port DRV_N9, port DRV_N10
COM_C_3: 11_X1.40 12_X1.40 13_X1.40 14_X1.40 ; port DRV_N13, port DRV_N14, port DRV_N15, port DRV_N16
COM_C_4: 11_X1.42 12_X1.42 13_X1.42 14_X1.42 ; port DRV_N19, port DRV_N20, port DRV_N21, port DRV_N22
COM_C_5: 11_X1.44 12_X1.44 13_X1.44 14_X1.44 ; port DRV_N25, port DRV_N26, port DRV_N27, port DRV_N28
COM_C_6: 11_X1.46 12_X1.46 13_X1.46 14_X1.46 ; port DRV_N31, port DRV_N32, port DRV_N33, port DRV_N34
COM_C_7: 11_X1.48 12_X1.48 13_X1.48 14_X1.48 ; port DRV_N37, port DRV_N38, port DRV_N39, port DRV_N40
COM_C_8: 11_X1.50 12_X1.50 13_X1.50 14_X1.50 ; port DRV_N43, port DRV_N44, port DRV_N45, port DRV_N46
COM_C_9: 11_X2.36 12_X2.36 13_X2.36 14_X2.36 ; port DRV_N49, port DRV_N50, port DRV_N51, port DRV_N52
COM_C_10: 11_X2.38 12_X2.38 13_X2.38 14_X2.38 ; port DRV_N55, port DRV_N56, port DRV_N57, port DRV_N58
COM_C_11: 11_X2.40 12_X2.40 13_X2.40 14_X2.40 ; port DRV_N5, port DRV_N6, port DRV_N35, port DRV_N36
COM_C_12: 11_X2.42 12_X2.42 13_X2.42 14_X2.42 ; port DRV_N11, port DRV_N12, port DRV_N41, port DRV_N42
COM_C_13: 11_X2.44 12_X2.44 13_X2.44 14_X2.44 ; port DRV_N17, port DRV_N18, port DRV_N47, port DRV_N48
COM_C_14: 11_X2.46 12_X2.46 13_X2.46 14_X2.46 ; port DRV_N23, port DRV_N24, port DRV_N53, port DRV_N54
COM_C_15: 11_X2.48 12_X2.48 13_X2.48 14_X2.48 ; port DRV_N29, port DRV_N30, port DRV_N59, port DRV_N60
NC_C_1: 11_X1.19 12_X1.19 13_X1.19 14_X1.19  [also labelled opt_1, opt_2, opt_3, opt_4]
NC_C_2: 11_X1.21 12_X1.21 13_X1.21 14_X1.21  [also labelled opt_10, opt_7, opt_8, opt_9]
NC_C_3: 11_X1.23 12_X1.23 13_X1.23 14_X1.23  [also labelled opt_13, opt_14, opt_15, opt_16]
NC_C_4: 11_X1.25 12_X1.25 13_X1.25 14_X1.25  [also labelled opt_19, opt_20, opt_21, opt_22]
NC_C_5: 11_X1.27 12_X1.27 13_X1.27 14_X1.27  [also labelled opt_25, opt_26, opt_27, opt_28]
NC_C_6: 11_X1.29 12_X1.29 13_X1.29 14_X1.29  [also labelled opt_31, opt_32, opt_33, opt_34]
NC_C_7: 11_X1.31 12_X1.31 13_X1.31 14_X1.31  [also labelled opt_37, opt_38, opt_39, opt_40]
NC_C_8: 11_X1.33 12_X1.33 13_X1.33 14_X1.33  [also labelled opt_43, opt_44, opt_45, opt_46]
NC_C_9: 11_X2.19 12_X2.19 13_X2.19 14_X2.19  [also labelled opt_49, opt_50, opt_51, opt_52]
NC_C_10: 11_X2.21 12_X2.21 13_X2.21 14_X2.21  [also labelled opt_55, opt_56, opt_57, opt_58]
NC_C_11: 11_X2.23 12_X2.23 13_X2.23 14_X2.23  [also labelled opt_35, opt_36, opt_5, opt_6]
NC_C_12: 11_X2.25 12_X2.25 13_X2.25 14_X2.25  [also labelled opt_11, opt_12, opt_41, opt_42]
NC_C_13: 11_X2.27 12_X2.27 13_X2.27 14_X2.27  [also labelled opt_17, opt_18, opt_47, opt_48]
NC_C_14: 11_X2.29 12_X2.29 13_X2.29 14_X2.29  [also labelled opt_23, opt_24, opt_53, opt_54]
NC_C_15: 11_X2.31 12_X2.31 13_X2.31 14_X2.31  [also labelled opt_29, opt_30, opt_59, opt_60]
NO_B_1: 11_X1.1 11_X1.3 11_X1.5 11_X1.7 11_X1.9 11_X1.11 11_X1.13 11_X1.15 11_X2.1 11_X2.3 12_X1.1 12_X1.3 12_X1.5 12_X1.7 12_X1.9 12_X1.11 12_X1.13 12_X1.15 12_X2.1 12_X2.3 13_X1.1 13_X1.3 13_X1.5 13_X1.7 13_X1.9 13_X1.11 13_X1.13 13_X1.15 13_X2.1 13_X2.3 14_X1.1 14_X1.3 14_X1.5 14_X1.7 14_X1.9 14_X1.11 14_X1.13 14_X1.15 14_X2.1 14_X2.3 ; port L1, port L2, port L3, port L4  [also labelled NO_B_10, NO_B_2, NO_B_3, NO_B_4, NO_B_5, NO_B_6, NO_B_7, NO_B_8, NO_B_9]  [project net COM_B_1]
NO_B_11: 11_X2.5 11_X2.9 11_X2.11 11_X2.13 12_X2.5 12_X2.9 12_X2.11 12_X2.13 13_X2.5 13_X2.9 13_X2.11 13_X2.13 14_X2.5 14_X2.9 14_X2.11 14_X2.13 ; port L5, port L6  [also labelled NO_B_13, NO_B_14, NO_B_15]  [project net COM_B_10]
NO_B_12: 11_X2.6 11_X2.7 11_X2.8 11_X2.10 11_X2.12 11_X2.14 12_X2.6 12_X2.7 12_X2.8 12_X2.10 12_X2.12 12_X2.14 13_X2.6 13_X2.7 13_X2.8 13_X2.10 13_X2.12 13_X2.14 14_X2.6 14_X2.7 14_X2.8 14_X2.10 14_X2.12 14_X2.14 ; port N5, port N6  [also labelled NO_C_11, NO_C_12, NO_C_13, NO_C_14, NO_C_15]  [project net COM_B_11]
NO_C_1: 11_X1.2 11_X1.4 11_X1.6 11_X1.8 11_X1.10 11_X1.12 11_X1.14 11_X1.16 11_X2.2 11_X2.4 12_X1.2 12_X1.4 12_X1.6 12_X1.8 12_X1.10 12_X1.12 12_X1.14 12_X1.16 12_X2.2 12_X2.4 13_X1.2 13_X1.4 13_X1.6 13_X1.8 13_X1.10 13_X1.12 13_X1.14 13_X1.16 13_X2.2 13_X2.4 14_X1.2 14_X1.4 14_X1.6 14_X1.8 14_X1.10 14_X1.12 14_X1.14 14_X1.16 14_X2.2 14_X2.4 ; port N1, port N2, port N3, port N4  [also labelled NO_C_10, NO_C_2, NO_C_3, NO_C_4, NO_C_5, NO_C_6, NO_C_7, NO_C_8, NO_C_9]  [project net COM_B_3]

Not connected (* = marked no-connect by the designer): 11_X1 17* 34*; 11_X2 17* 32 33 34*; 12_X1 17* 34*; 12_X2 17* 32 33 34*; 13_X1 17* 34*; 13_X2 17* 32 33 34*; 14_X1 17* 34*; 14_X2 17* 32 33 34*

### Buses and harness runs
bus opt[1..60] = port opt[60]

## Sheet MB-01.SchDoc
size A
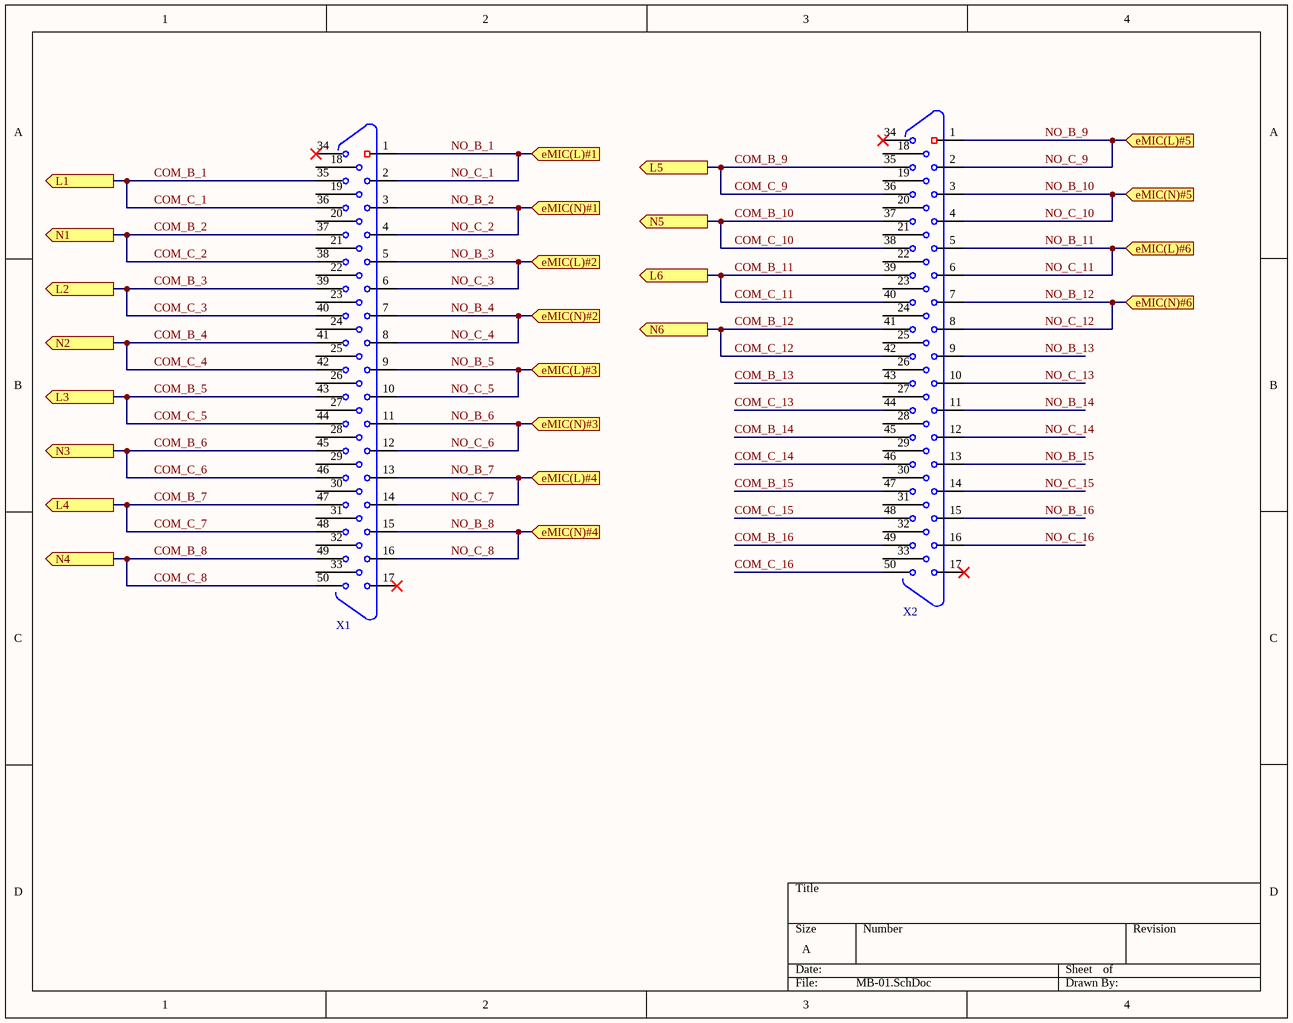
[diagram p4: MB-01.SchDoc]

### Parts
X1  DB50  [DB50_RA]  (value not drawn)
X2  DB50  [DB50_RA]  (value not drawn)

### Ports
eMIC(L)#1 (in), eMIC(L)#2 (in), eMIC(L)#3 (in), eMIC(L)#4 (in), eMIC(L)#5 (in), eMIC(L)#6 (in), eMIC(N)#1 (in), eMIC(N)#2 (in), eMIC(N)#3 (in), eMIC(N)#4 (in), eMIC(N)#5 (in), eMIC(N)#6 (in), L1 (out), L2 (out), L3 (out), L4 (out), L5 (out), L6 (out), N1 (out), N2 (out), N3 (out), N4 (out), N5 (out), N6 (out)

### Nets
COM_B_1: X1.35 X1.36 X1.37 X1.38 X1.43 X1.44 X1.45 X1.46 ; port L1, port L3, port N1, port N3  [also labelled COM_B_2, COM_B_5, COM_B_6, COM_C_1, COM_C_2, COM_C_5, COM_C_6]
COM_B_3: X1.39 X1.40 X1.41 X1.42 X1.47 X1.48 X1.49 X1.50 ; port L2, port L4, port N2, port N4  [also labelled COM_B_4, COM_B_7, COM_B_8, COM_C_3, COM_C_4, COM_C_7, COM_C_8]
COM_B_10: X2.35 X2.36 X2.37 X2.38 ; port L5, port N5  [also labelled COM_B_9, COM_C_10, COM_C_9]
COM_B_11: X2.39 X2.40 X2.41 X2.42 ; port L6, port N6  [also labelled COM_B_12, COM_C_11, COM_C_12]
COM_B_13: X2.43
COM_B_14: X2.45
COM_B_15: X2.47
COM_B_16: X2.49
COM_C_13: X2.44
COM_C_14: X2.46
COM_C_15: X2.48
COM_C_16: X2.50
NO_B_1: X1.1 X1.2 ; port eMIC(L)#1  [also labelled NO_C_1]
NO_B_2: X1.3 X1.4 ; port eMIC(N)#1  [also labelled NO_C_2]
NO_B_3: X1.5 X1.6 ; port eMIC(L)#2  [also labelled NO_C_3]
NO_B_4: X1.7 X1.8 ; port eMIC(N)#2  [also labelled NO_C_4]
NO_B_5: X1.9 X1.10 ; port eMIC(L)#3  [also labelled NO_C_5]
NO_B_6: X1.11 X1.12 ; port eMIC(N)#3  [also labelled NO_C_6]
NO_B_7: X1.13 X1.14 ; port eMIC(L)#4  [also labelled NO_C_7]
NO_B_8: X1.15 X1.16 ; port eMIC(N)#4  [also labelled NO_C_8]
NO_B_9: X2.1 X2.2 ; port eMIC(L)#5  [also labelled NO_C_9]
NO_B_10: X2.3 X2.4 ; port eMIC(N)#5  [also labelled NO_C_10]
NO_B_11: X2.5 X2.6 ; port eMIC(L)#6  [also labelled NO_C_11]
NO_B_12: X2.7 X2.8 ; port eMIC(N)#6  [also labelled NO_C_12]
NO_B_13: X2.9
NO_B_14: X2.11
NO_B_15: X2.13
NO_B_16: X2.15
NO_C_13: X2.10
NO_C_14: X2.12
NO_C_15: X2.14
NO_C_16: X2.16

Not connected (* = marked no-connect by the designer): X1 17* 18 19 20 21 22 23 24(7) 25(3) 26 27 28 29 30 31 32 33 34*; X2 17* 18 19 20 21 22 23 24(7) 25(3) 26 27 28 29 30 31 32 33 34*

## Sheet eMIC-CE14.SchDoc
size A
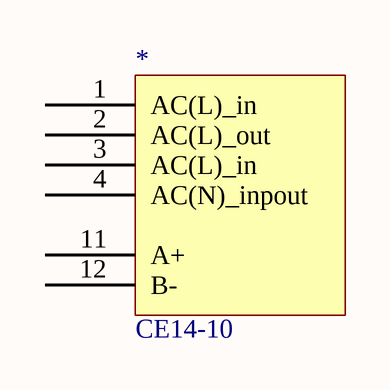
[diagram p5: eMIC-CE14.SchDoc]

### Parts
*  CE14-10

### Nets

Not connected (* = marked no-connect by the designer): * 1(AC(L)_in) 2(AC(L)_out) 3(AC(L)_in) 4(AC(N)_inpout) 11(A+) 12(B-)

## Sheet mux10-1.SchDoc
size A2
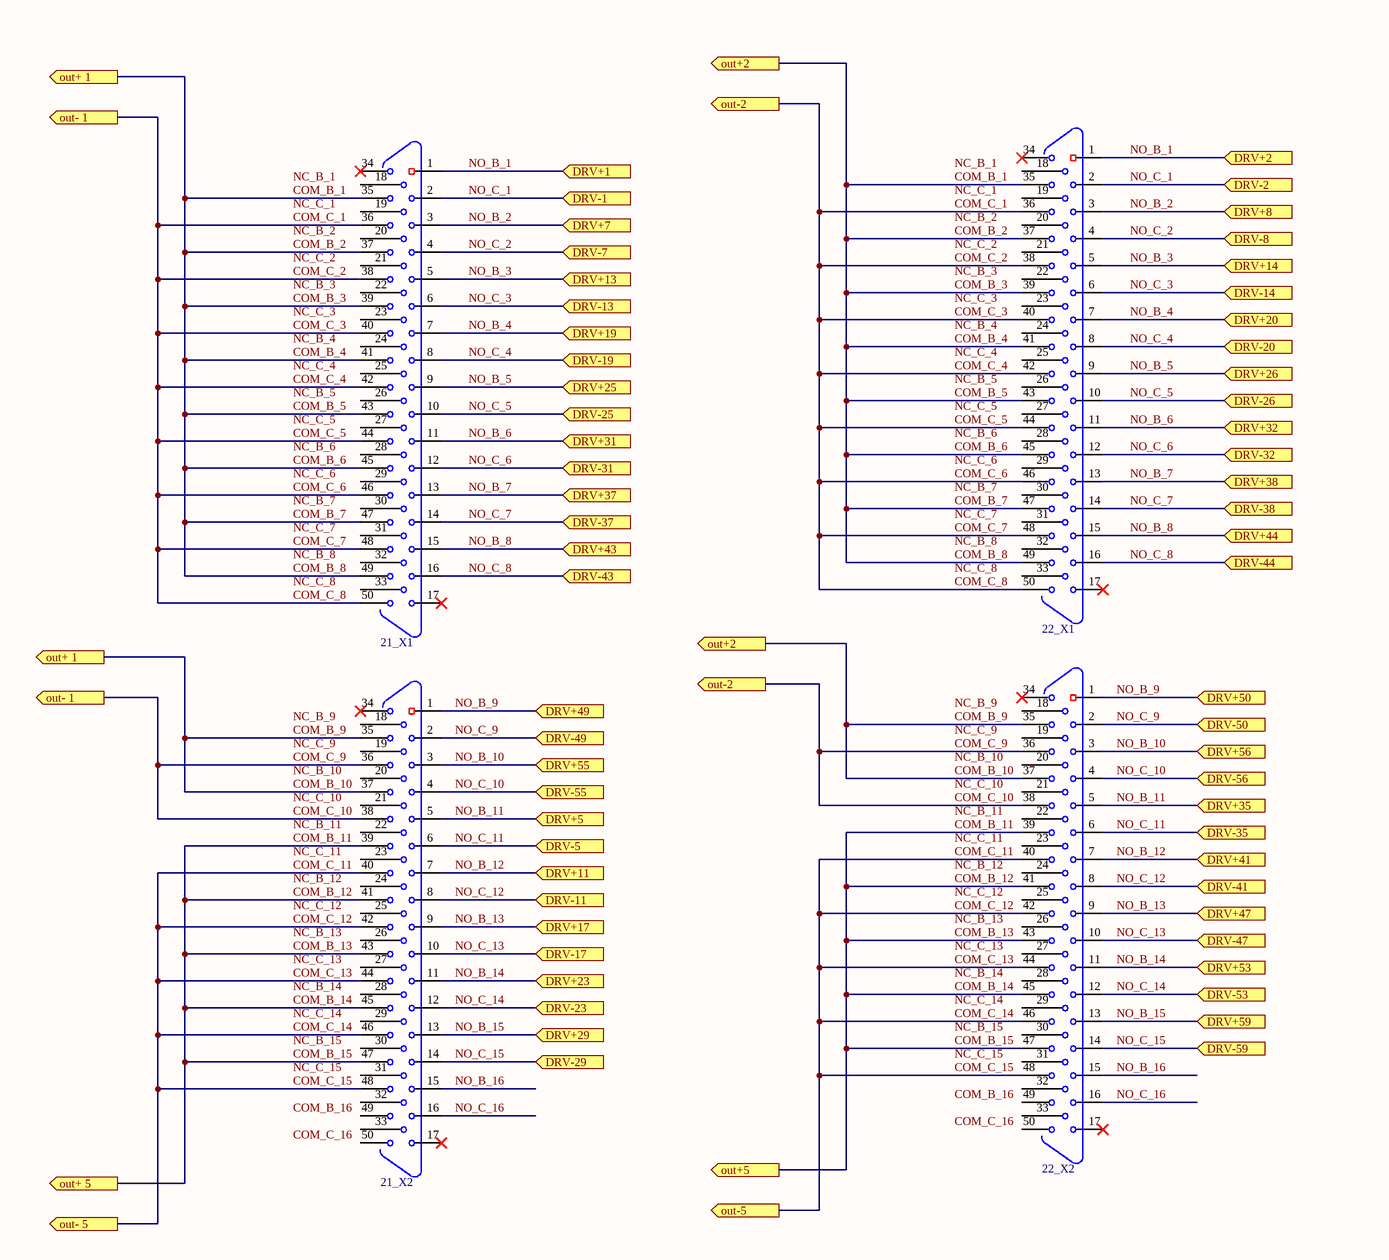
[diagram p6: mux10-1.SchDoc, left]
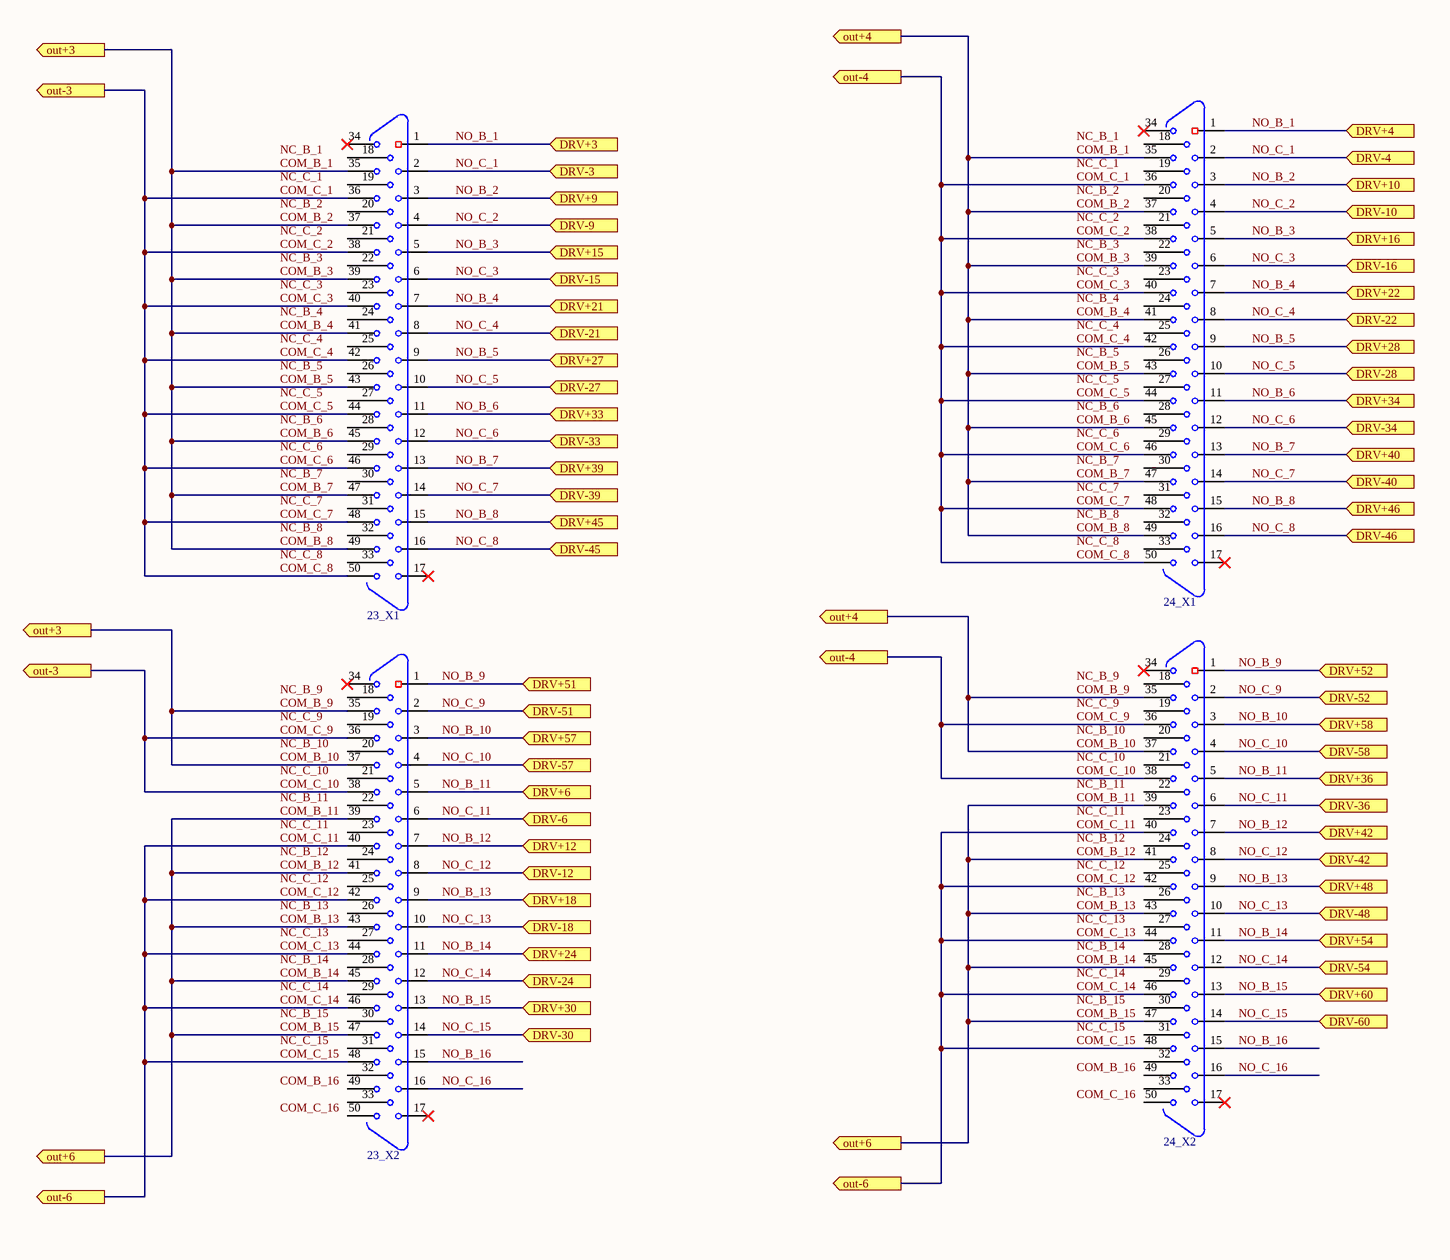
[diagram p7: mux10-1.SchDoc, right]

### Parts
21_X1  DB50  [DB50_RA]  (value not drawn)
21_X2  DB50  [DB50_RA]  (value not drawn)
22_X1  DB50  [DB50_RA]  (value not drawn)
22_X2  DB50  [DB50_RA]  (value not drawn)
23_X1  DB50  [DB50_RA]  (value not drawn)
23_X2  DB50  [DB50_RA]  (value not drawn)
24_X1  DB50  [DB50_RA]  (value not drawn)
24_X2  DB50  [DB50_RA]  (value not drawn)

### Ports
DRV+1 (in), DRV+2 (in), DRV+3 (in), DRV+4 (in), DRV+5 (in), DRV+6 (in), DRV+7 (in), DRV+8 (in), DRV+9 (in), DRV+10 (in), DRV+11 (in), DRV+12 (in), DRV+13 (in), DRV+14 (in), DRV+15 (in), DRV+16 (in), DRV+17 (in), DRV+18 (in), DRV+19 (in), DRV+20 (in), DRV+21 (in), DRV+22 (in), DRV+23 (in), DRV+24 (in), DRV+25 (in), DRV+26 (in), DRV+27 (in), DRV+28 (in), DRV+29 (in), DRV+30 (in), DRV+31 (in), DRV+32 (in), DRV+33 (in), DRV+34 (in), DRV+35 (in), DRV+36 (in), DRV+37 (in), DRV+38 (in), DRV+39 (in), DRV+40 (in), DRV+41 (in), DRV+42 (in), DRV+43 (in), DRV+44 (in), DRV+45 (in), DRV+46 (in), DRV+47 (in), DRV+48 (in), DRV+49 (in), DRV+50 (in), DRV+51 (in), DRV+52 (in), DRV+53 (in), DRV+54 (in), DRV+55 (in), DRV+56 (in), DRV+57 (in), DRV+58 (in), DRV+59 (in), DRV+60 (in), DRV-1 (in), DRV-2 (in), DRV-3 (in), DRV-4 (in), DRV-5 (in), DRV-6 (in), DRV-7 (in), DRV-8 (in), DRV-9 (in), DRV-10 (in), DRV-11 (in), DRV-12 (in), DRV-13 (in), DRV-14 (in), DRV-15 (in), DRV-16 (in), DRV-17 (in), DRV-18 (in), DRV-19 (in), DRV-20 (in), DRV-21 (in), DRV-22 (in), DRV-23 (in), DRV-24 (in), DRV-25 (in), DRV-26 (in), DRV-27 (in), DRV-28 (in), DRV-29 (in), DRV-30 (in), DRV-31 (in), DRV-32 (in), DRV-33 (in), DRV-34 (in), DRV-35 (in), DRV-36 (in), DRV-37 (in), DRV-38 (in), DRV-39 (in), DRV-40 (in), DRV-41 (in), DRV-42 (in), DRV-43 (in), DRV-44 (in), DRV-45 (in), DRV-46 (in), DRV-47 (in), DRV-48 (in), DRV-49 (in), DRV-50 (in), DRV-51 (in), DRV-52 (in), DRV-53 (in), DRV-54 (in), DRV-55 (in), DRV-56 (in), DRV-57 (in), DRV-58 (in), DRV-59 (in), DRV-60 (in), out+2 (out), out+3 (out), out+4 (out), out+5 (out), out+6 (out), out+ 1 (out), out+ 5 (out), out-2 (out), out-3 (out), out-4 (out), out-5 (out), out-6 (out), out- 1 (out), out- 5 (out)

### Nets
COM_B_1: 21_X1.35 21_X1.37 21_X1.39 21_X1.41 21_X1.43 21_X1.45 21_X1.47 21_X1.49 21_X2.35 21_X2.37 22_X1.35 22_X1.37 22_X1.39 22_X1.41 22_X1.43 22_X1.45 22_X1.47 22_X1.49 22_X2.35 22_X2.37 23_X1.35 23_X1.37 23_X1.39 23_X1.41 23_X1.43 23_X1.45 23_X1.47 23_X1.49 23_X2.35 23_X2.37 24_X1.35 24_X1.37 24_X1.39 24_X1.41 24_X1.43 24_X1.45 24_X1.47 24_X1.49 24_X2.35 24_X2.37 ; port out+ 1, port out+2, port out+3, port out+4  [also labelled COM_B_10, COM_B_2, COM_B_3, COM_B_4, COM_B_5, COM_B_6, COM_B_7, COM_B_8, COM_B_9]
COM_B_11: 21_X2.39 21_X2.41 21_X2.43 21_X2.45 21_X2.47 22_X2.39 22_X2.41 22_X2.43 22_X2.45 22_X2.47 23_X2.39 23_X2.41 23_X2.43 23_X2.45 23_X2.47 24_X2.39 24_X2.41 24_X2.43 24_X2.45 24_X2.47 ; port out+ 5, port out+5, port out+6  [also labelled COM_B_12, COM_B_13, COM_B_14, COM_B_15]
COM_C_1: 21_X1.36 21_X1.38 21_X1.40 21_X1.42 21_X1.44 21_X1.46 21_X1.48 21_X1.50 21_X2.36 21_X2.38 22_X1.36 22_X1.38 22_X1.40 22_X1.42 22_X1.44 22_X1.46 22_X1.48 22_X1.50 22_X2.36 22_X2.38 23_X1.36 23_X1.38 23_X1.40 23_X1.42 23_X1.44 23_X1.46 23_X1.48 23_X1.50 23_X2.36 23_X2.38 24_X1.36 24_X1.38 24_X1.40 24_X1.42 24_X1.44 24_X1.46 24_X1.48 24_X1.50 24_X2.36 24_X2.38 ; port out- 1, port out-2, port out-3, port out-4  [also labelled COM_C_10, COM_C_2, COM_C_3, COM_C_4, COM_C_5, COM_C_6, COM_C_7, COM_C_8, COM_C_9]
COM_C_11: 21_X2.40 21_X2.42 21_X2.44 21_X2.46 21_X2.48 22_X2.40 22_X2.42 22_X2.44 22_X2.46 22_X2.48 23_X2.40 23_X2.42 23_X2.44 23_X2.46 23_X2.48 24_X2.40 24_X2.42 24_X2.44 24_X2.46 24_X2.48 ; port out- 5, port out-5, port out-6  [also labelled COM_C_12, COM_C_13, COM_C_14, COM_C_15]
NO_B_1: 21_X1.1 22_X1.1 23_X1.1 24_X1.1 ; port DRV+1, port DRV+2, port DRV+3, port DRV+4
NO_B_2: 21_X1.3 22_X1.3 23_X1.3 24_X1.3 ; port DRV+7, port DRV+8, port DRV+9, port DRV+10
NO_B_3: 21_X1.5 22_X1.5 23_X1.5 24_X1.5 ; port DRV+13, port DRV+14, port DRV+15, port DRV+16
NO_B_4: 21_X1.7 22_X1.7 23_X1.7 24_X1.7 ; port DRV+19, port DRV+20, port DRV+21, port DRV+22
NO_B_5: 21_X1.9 22_X1.9 23_X1.9 24_X1.9 ; port DRV+25, port DRV+26, port DRV+27, port DRV+28
NO_B_6: 21_X1.11 22_X1.11 23_X1.11 24_X1.11 ; port DRV+31, port DRV+32, port DRV+33, port DRV+34
NO_B_7: 21_X1.13 22_X1.13 23_X1.13 24_X1.13 ; port DRV+37, port DRV+38, port DRV+39, port DRV+40
NO_B_8: 21_X1.15 22_X1.15 23_X1.15 24_X1.15 ; port DRV+43, port DRV+44, port DRV+45, port DRV+46
NO_B_9: 21_X2.1 22_X2.1 23_X2.1 24_X2.1 ; port DRV+49, port DRV+50, port DRV+51, port DRV+52
NO_B_10: 21_X2.3 22_X2.3 23_X2.3 24_X2.3 ; port DRV+55, port DRV+56, port DRV+57, port DRV+58
NO_B_11: 21_X2.5 22_X2.5 23_X2.5 24_X2.5 ; port DRV+5, port DRV+35, port DRV+6, port DRV+36
NO_B_12: 21_X2.7 22_X2.7 23_X2.7 24_X2.7 ; port DRV+11, port DRV+41, port DRV+12, port DRV+42
NO_B_13: 21_X2.9 22_X2.9 23_X2.9 24_X2.9 ; port DRV+17, port DRV+47, port DRV+18, port DRV+48
NO_B_14: 21_X2.11 22_X2.11 23_X2.11 24_X2.11 ; port DRV+23, port DRV+53, port DRV+24, port DRV+54
NO_B_15: 21_X2.13 22_X2.13 23_X2.13 24_X2.13 ; port DRV+29, port DRV+59, port DRV+30, port DRV+60
NO_B_16: 21_X2.15 22_X2.15 23_X2.15 24_X2.15
NO_C_1: 21_X1.2 22_X1.2 23_X1.2 24_X1.2 ; port DRV-1, port DRV-2, port DRV-3, port DRV-4
NO_C_2: 21_X1.4 22_X1.4 23_X1.4 24_X1.4 ; port DRV-7, port DRV-8, port DRV-9, port DRV-10
NO_C_3: 21_X1.6 22_X1.6 23_X1.6 24_X1.6 ; port DRV-13, port DRV-14, port DRV-15, port DRV-16
NO_C_4: 21_X1.8 22_X1.8 23_X1.8 24_X1.8 ; port DRV-19, port DRV-20, port DRV-21, port DRV-22
NO_C_5: 21_X1.10 22_X1.10 23_X1.10 24_X1.10 ; port DRV-25, port DRV-26, port DRV-27, port DRV-28
NO_C_6: 21_X1.12 22_X1.12 23_X1.12 24_X1.12 ; port DRV-31, port DRV-32, port DRV-33, port DRV-34
NO_C_7: 21_X1.14 22_X1.14 23_X1.14 24_X1.14 ; port DRV-37, port DRV-38, port DRV-39, port DRV-40
NO_C_8: 21_X1.16 22_X1.16 23_X1.16 24_X1.16 ; port DRV-43, port DRV-44, port DRV-45, port DRV-46
NO_C_9: 21_X2.2 22_X2.2 23_X2.2 24_X2.2 ; port DRV-49, port DRV-50, port DRV-51, port DRV-52
NO_C_10: 21_X2.4 22_X2.4 23_X2.4 24_X2.4 ; port DRV-55, port DRV-56, port DRV-57, port DRV-58
NO_C_11: 21_X2.6 22_X2.6 23_X2.6 24_X2.6 ; port DRV-5, port DRV-35, port DRV-6, port DRV-36
NO_C_12: 21_X2.8 22_X2.8 23_X2.8 24_X2.8 ; port DRV-11, port DRV-41, port DRV-12, port DRV-42
NO_C_13: 21_X2.10 22_X2.10 23_X2.10 24_X2.10 ; port DRV-17, port DRV-47, port DRV-18, port DRV-48
NO_C_14: 21_X2.12 22_X2.12 23_X2.12 24_X2.12 ; port DRV-23, port DRV-53, port DRV-24, port DRV-54
NO_C_15: 21_X2.14 22_X2.14 23_X2.14 24_X2.14 ; port DRV-29, port DRV-59, port DRV-30, port DRV-60
NO_C_16: 21_X2.16 22_X2.16 23_X2.16 24_X2.16

Not connected (* = marked no-connect by the designer): 21_X1 17* 18 19 20 21 22 23 24(7) 25(3) 26 27 28 29 30 31 32 33 34*; 21_X2 17* 18 19 20 21 22 23 24(7) 25(3) 26 27 28 29 30 31 32 33 34* 49 50; 22_X1 17* 18 19 20 21 22 23 24(7) 25(3) 26 27 28 29 30 31 32 33 34*; 22_X2 17* 18 19 20 21 22 23 24(7) 25(3) 26 27 28 29 30 31 32 33 34* 49 50; 23_X1 17* 18 19 20 21 22 23 24(7) 25(3) 26 27 28 29 30 31 32 33 34*; 23_X2 17* 18 19 20 21 22 23 24(7) 25(3) 26 27 28 29 30 31 32 33 34* 49 50; 24_X1 17* 18 19 20 21 22 23 24(7) 25(3) 26 27 28 29 30 31 32 33 34*; 24_X2 17* 18 19 20 21 22 23 24(7) 25(3) 26 27 28 29 30 31 32 33 34* 49 50

### Notes on the sheet
- Labels drawn without touching a wire or pin: COM_B_16, COM_C_16, NC_B_1, NC_B_2, NC_B_3, NC_B_4, NC_B_5, NC_B_6, NC_B_7, NC_B_8, NC_B_9, NC_B_10, NC_B_11, NC_B_12, NC_B_13, NC_B_14, NC_B_15, NC_C_1, NC_C_2, NC_C_3, NC_C_4, NC_C_5, NC_C_6, NC_C_7, NC_C_8, NC_C_9, NC_C_10, NC_C_11, NC_C_12, NC_C_13, NC_C_14, NC_C_15

## Sheet mux6-1(3wires).SchDoc
size A2
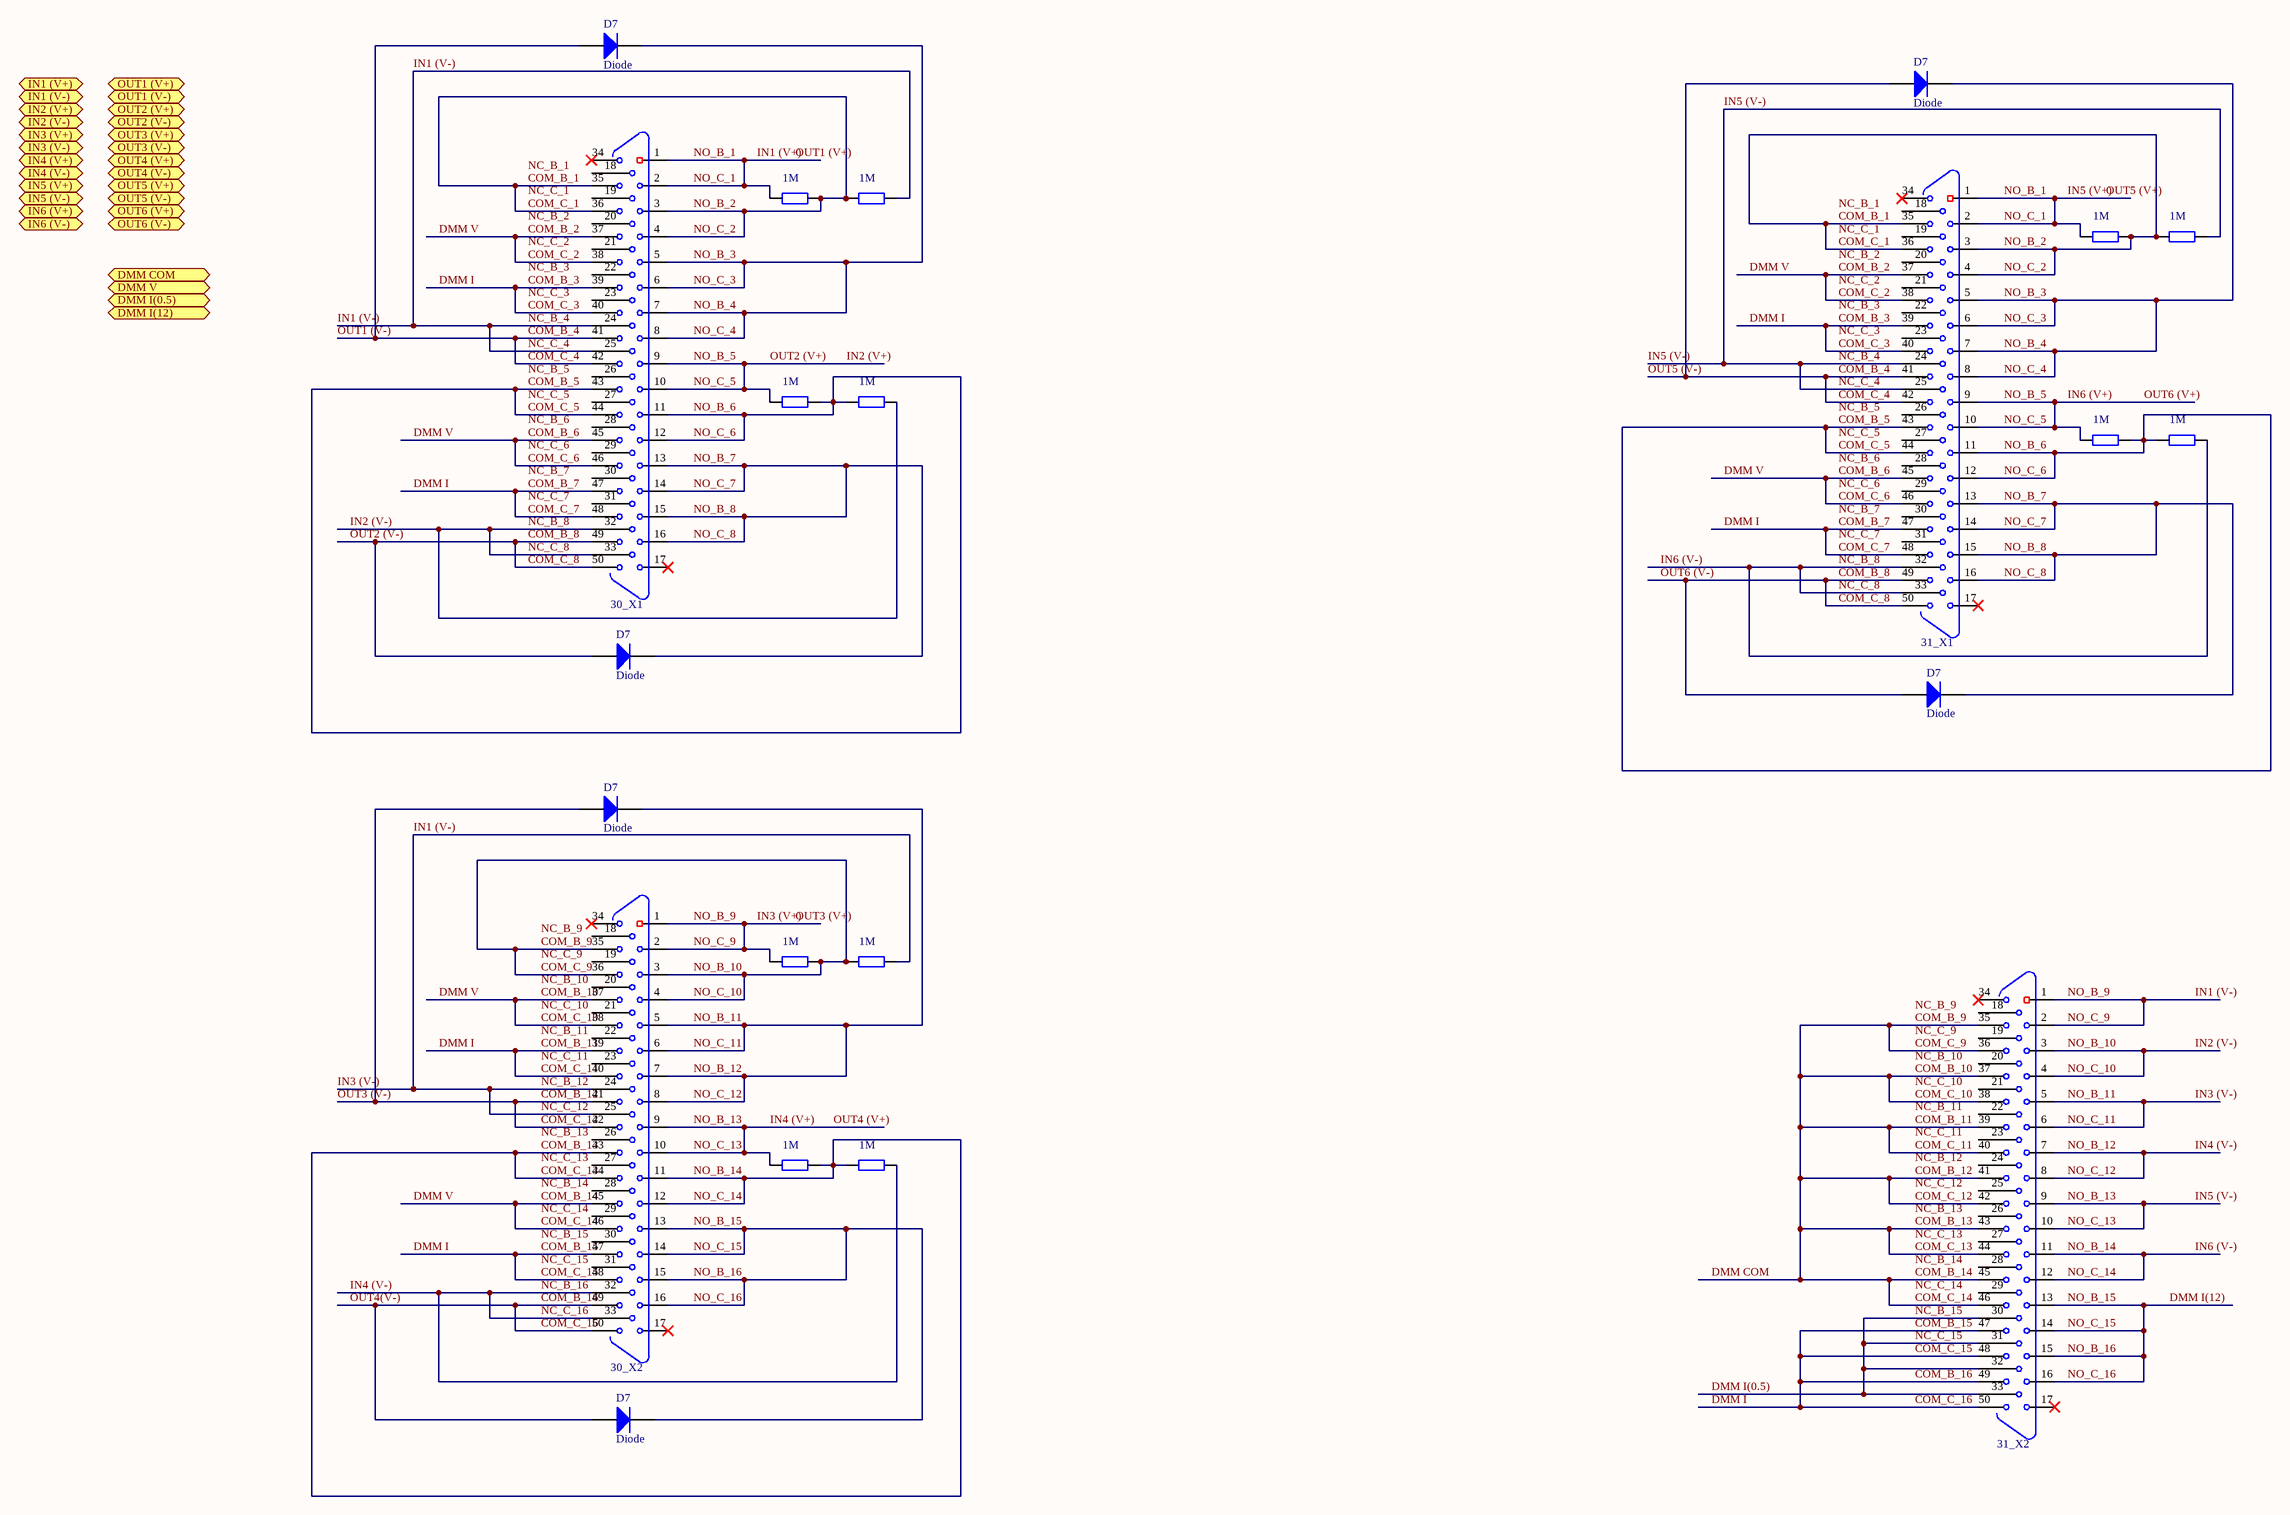
[diagram p8: mux6-1(3wires).SchDoc]

### Parts
(Parts that share a designator on the sheet are numbered #1, #2 ... from top to bottom, then left to right.)
30_X1  DB50  [DB50_RA]  (value not drawn)
30_X2  DB50  [DB50_RA]  (value not drawn)
31_X1  DB50  [DB50_RA]  (value not drawn)
31_X2  DB50  [DB50_RA]  (value not drawn)
D7#1  Diode  [DSO-C2/X3.3]
D7#2  Diode  [DSO-C2/X3.3]
D7#3  Diode  [DSO-C2/X3.3]
D7#4  Diode  [DSO-C2/X3.3]
D7#5  Diode  [DSO-C2/X3.3]
D7#6  Diode  [DSO-C2/X3.3]
R1#1  value 1M  [AXIAL-0.4]  (hidden comment: Res2)
R1#2  value 1M  [AXIAL-0.4]  (hidden comment: Res2)
R1#3  value 1M  [AXIAL-0.4]  (hidden comment: Res2)
R1#4  value 1M  [AXIAL-0.4]  (hidden comment: Res2)
R1#5  value 1M  [AXIAL-0.4]  (hidden comment: Res2)
R1#6  value 1M  [AXIAL-0.4]  (hidden comment: Res2)
R2#1  value 1M  [AXIAL-0.4]  (hidden comment: Res2)
R2#2  value 1M  [AXIAL-0.4]  (hidden comment: Res2)
R2#3  value 1M  [AXIAL-0.4]  (hidden comment: Res2)
R2#4  value 1M  [AXIAL-0.4]  (hidden comment: Res2)
R2#5  value 1M  [AXIAL-0.4]  (hidden comment: Res2)
R2#6  value 1M  [AXIAL-0.4]  (hidden comment: Res2)

### Ports
DMM COM (out), DMM I(0.5) (out), DMM I(12) (out), DMM V (out), IN1 (V+) (in), IN1 (V-) (in), IN2 (V+) (in), IN2 (V-) (in), IN3 (V+) (in), IN3 (V-) (in), IN4 (V+) (in), IN4 (V-) (in), IN5 (V+) (in), IN5 (V-) (in), IN6 (V+) (in), IN6 (V-) (in), OUT1 (V+) (out), OUT1 (V-) (out), OUT2 (V+) (out), OUT2 (V-) (out), OUT3 (V+) (out), OUT3 (V-) (out), OUT4 (V+) (out), OUT4 (V-) (out), OUT5 (V+) (out), OUT5 (V-) (out), OUT6 (V+) (out), OUT6 (V-) (out)

### Nets
COM_B_1: 30_X1.3 30_X1.4 30_X1.35 30_X1.36 31_X1.3 31_X1.4 31_X1.35 31_X1.36 R1#1.2 R1#2.2 R2#1.1 R2#2.1  [also labelled COM_C_1, NO_B_2, NO_C_2]
COM_B_4: 30_X1.41 30_X1.42 31_X1.41 31_X1.42 D7#1.1(A) D7#2.1(A)  [also labelled COM_C_4, OUT1 (V-), OUT5 (V-)]
COM_B_5: 30_X1.11 30_X1.12 30_X1.43 30_X1.44 31_X1.11 31_X1.12 31_X1.43 31_X1.44 R1#3.2 R1#4.2 R2#3.1 R2#4.1  [also labelled COM_C_5, NO_B_6, NO_C_6]
COM_B_8: 30_X1.49 30_X1.50 31_X1.49 31_X1.50 D7#3.1(A) D7#4.1(A)  [also labelled COM_C_8, OUT2 (V-), OUT6 (V-)]
COM_B_10: 30_X1.32 30_X1.33 30_X1.37 30_X1.38 30_X1.39 30_X1.40 30_X1.45 30_X1.46 30_X1.47 30_X1.48 30_X2.3 30_X2.4 30_X2.11 30_X2.12 30_X2.35 30_X2.36 30_X2.37 30_X2.38 30_X2.39 30_X2.40 30_X2.41 30_X2.42 30_X2.43 30_X2.44 30_X2.45 30_X2.46 30_X2.47 30_X2.48 30_X2.49 30_X2.50 31_X1.32 31_X1.33 31_X1.37 31_X1.38 31_X1.39 31_X1.40 31_X1.45 31_X1.46 31_X1.47 31_X1.48 31_X2.3 31_X2.4 31_X2.11 31_X2.12 31_X2.35 31_X2.36 31_X2.37 31_X2.38 31_X2.39 31_X2.40 31_X2.41 31_X2.42 31_X2.43 31_X2.44 31_X2.45 31_X2.46 31_X2.47 31_X2.48 31_X2.49 31_X2.50 D7#5.1(A) D7#6.1(A) R1#5.2 R1#6.2 R2#3.2 R2#4.2 R2#5.1 R2#6.1  [also labelled COM_B_11, COM_B_12, COM_B_13, COM_B_14, COM_B_15, COM_B_16, COM_B_2, COM_B_3, COM_B_6, COM_B_7, COM_B_9, COM_C_10, COM_C_11, COM_C_12, COM_C_13, COM_C_14, COM_C_15, COM_C_16, COM_C_2, COM_C_3, COM_C_6, COM_C_7, COM_C_9, DMM COM, DMM I, DMM V, IN2 (V-), IN6 (V-), NC_B_8, NC_C_8, NO_B_10, NO_B_14, NO_C_10, NO_C_14, OUT3 (V-), OUT4(V-)]
DMM I(0.5): 31_X2.30 31_X2.31 31_X2.32 31_X2.33  [also labelled NC_B_15, NC_C_15]
DMM I(12): 30_X2.13 30_X2.14 30_X2.15 30_X2.16 31_X2.13 31_X2.14 31_X2.15 31_X2.16 D7#6.2(K)  [also labelled NO_B_15, NO_B_16, NO_C_15, NO_C_16]
IN1 (V+): 30_X1.1 30_X1.2 31_X1.1 31_X1.2 R1#1.1 R1#2.1  [also labelled IN5 (V+), NO_B_1, NO_C_1, OUT1 (V+), OUT5 (V+)]
IN1 (V-): 30_X1.24 30_X1.25 30_X2.1 30_X2.2 30_X2.5 30_X2.6 30_X2.7 30_X2.8 30_X2.9 30_X2.10 30_X2.24 30_X2.25 30_X2.32 30_X2.33 31_X1.24 31_X1.25 31_X2.1 31_X2.2 31_X2.5 31_X2.6 31_X2.7 31_X2.8 31_X2.9 31_X2.10 D7#5.2(K) R1#5.1 R1#6.1 R2#1.2 R2#2.2 R2#5.2 R2#6.2  [also labelled IN3 (V+), IN3 (V-), IN4 (V+), IN4 (V-), IN5 (V-), NC_B_12, NC_B_16, NC_B_4, NC_C_12, NC_C_16, NC_C_4, NO_B_11, NO_B_12, NO_B_13, NO_B_9, NO_C_11, NO_C_12, NO_C_13, NO_C_9, OUT3 (V+), OUT4 (V+)]
IN2 (V+): 30_X1.9 30_X1.10 31_X1.9 31_X1.10 R1#3.1 R1#4.1  [also labelled IN6 (V+), NO_B_5, NO_C_5, OUT2 (V+), OUT6 (V+)]
NO_B_3: 30_X1.5 30_X1.6 30_X1.7 30_X1.8 31_X1.5 31_X1.6 31_X1.7 31_X1.8 D7#1.2(K) D7#2.2(K)  [also labelled NO_B_4, NO_C_3, NO_C_4]
NO_B_7: 30_X1.13 30_X1.14 30_X1.15 30_X1.16 31_X1.13 31_X1.14 31_X1.15 31_X1.16 D7#3.2(K) D7#4.2(K)  [also labelled NO_B_8, NO_C_7, NO_C_8]

Not connected (* = marked no-connect by the designer): 30_X1 17* 18 19 20 21 22 23 26 27 28 29 30 31 34*; 30_X2 17* 18 19 20 21 22 23 26 27 28 29 30 31 34*; 31_X1 17* 18 19 20 21 22 23 26 27 28 29 30 31 34*; 31_X2 17* 18 19 20 21 22 23 24(7) 25(3) 26 27 28 29 34*

### Notes on the sheet
- Labels drawn without touching a wire or pin: NC_B_1, NC_B_2, NC_B_3, NC_B_5, NC_B_6, NC_B_7, NC_B_9, NC_B_10, NC_B_11, NC_B_12, NC_B_13, NC_B_14, NC_B_15, NC_C_1, NC_C_2, NC_C_3, NC_C_5, NC_C_6, NC_C_7, NC_C_9, NC_C_10, NC_C_11, NC_C_12, NC_C_13, NC_C_14, NC_C_15

### Library data of the parts
D7#1-D7#6 = Diode: Default Diode; Published: 8-Jun-2000; LatestRevisionDate: 17-Jul-2002; LatestRevisionNote: Re-released for DXP Platform.; PackageVersion: Sep-1996; PackageReference: SMC; Publisher: Altium Limited; Code_JEDEC: DO-214-AB
R1#1-R1#6 R2#1-R2#6 = Res2: Resistor; Published: 8-Jun-2000; LatestRevisionDate: 17-Jul-2002; LatestRevisionNote: Re-released for DXP Platform.; PackageReference: AXIAL-0.4; Publisher: Altium Limited